# EAGLE schematic mf_tray_mb_v9 (EAGLE 8.0.1)

## Sheet 1 of 8: Arduino Mega 2560
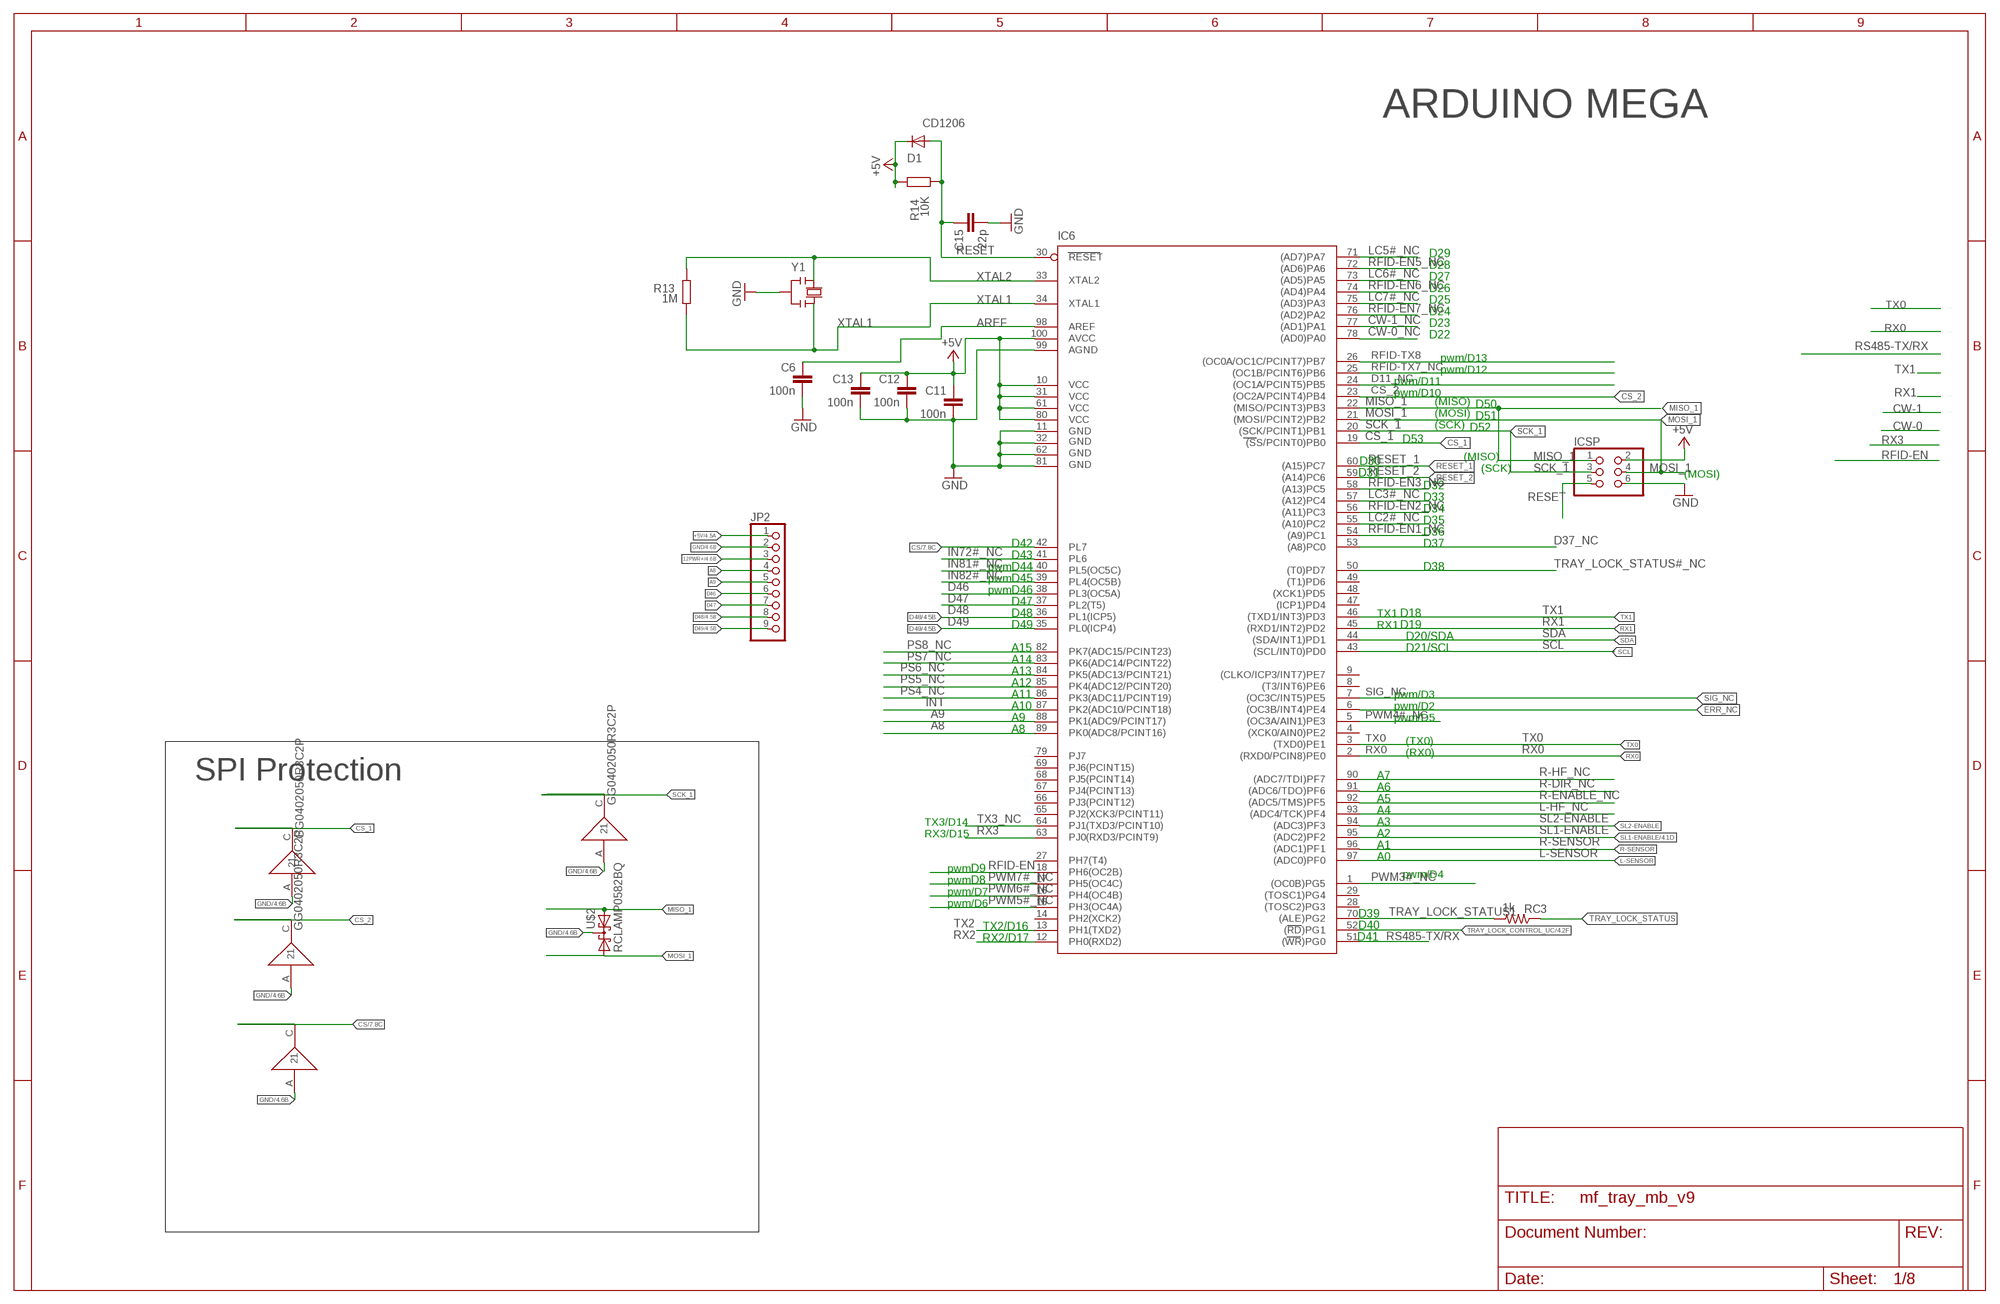
[diagram p0: schematic, sheet 1]

### Parts
C6  100n  C-EU0603-RND  [C0603-ROUND]
C11  100n  C-EU0603-RND  [C0603-ROUND]
C12  100n  C-EU0603-RND  [C0603-ROUND]
C13  100n  C-EU0603-RND  [C0603-ROUND]
C15  22p  C-EU0603-RND  [C0603-ROUND]
D1  CD1206  DIODE-MINIMELF  [MINIMELF]
IC6  ATMEGA25602560-16AU  [TQFP100]
ICSP  PINHD-2X3  [2X03]
JP2  PINHD-1X9  [1X09]
R13  1M  R-EU_R0603  [R0603-ROUND]
R14  10K  R-EU_R0603  [R0603-ROUND]
RC3  1k  R-US_R0603  [R0603@1]
U$1  GG0402050R3C2P  [0402]
U$2  RCLAMP0582BQ  [SOT416]
U$3  GG0402050R3C2P  [0402]
U$4  GG0402050R3C2P  [0402]
U$5  GG0402050R3C2P  [0402]
Y1  RESONATORMU  [RESONATOR]

### Nets
12PWR+ [power]: JP2.3 ; also sheet 2,4,6
+5V: C11.1 C12.1 C13.1 D1.C IC6.10(VCC) IC6.31(VCC1) IC6.61(VCC2) IC6.80(VCC3) IC6.100(AVCC) ICSP.2 JP2.1 R14.2 ; also sheet 2,3,4,5,6,7
A8: IC6.89(PK0(ADC8/PCINT16)) JP2.4
A9: IC6.88(PK1(ADC9/PCINT17)) JP2.5
AREF: C6.1 IC6.98(AREF)
CS: IC6.42(PL7) U$5.C ; also sheet 7
CS_1: IC6.19((SS/PCINT0)PB0) U$3.C ; also sheet 2
CS_2: IC6.23((OC2A/PCINT4)PB4) U$4.C ; also sheet 2
CW-0_NC: IC6.78((AD0)PA0)
CW-1_NC: IC6.77((AD1)PA1)
D11_NC: IC6.24((OC1A/PCINT5)PB5)
D37_NC: IC6.53((A8)PC0)
D46: IC6.38(PL3(OC5A)) JP2.6
D47: IC6.37(PL2(T5)) JP2.7
D48: IC6.36(PL1(ICP5)) JP2.8 ; also sheet 4
D49: IC6.35(PL0(ICP4)) JP2.9 ; also sheet 4
ERR_NC: IC6.6((OC3B/INT4)PE4)
GND: C6.2 C11.2 C12.2 C13.2 C15.2 IC6.11(GND) IC6.32(GND1) IC6.62(GND2) IC6.81(GND3) IC6.99(AGND) ICSP.6 JP2.2 U$1.A U$2.3(K1K2) U$3.A U$4.A U$5.A Y1.2 ; also sheet 2,3,4,5,6,7
IN72#_NC: IC6.41(PL6)
IN81#_NC: IC6.40(PL5(OC5C))
IN82#_NC: IC6.39(PL4(OC5B))
INT: IC6.87(PK2(ADC10/PCINT18)) ; also sheet 7
L-HF_NC: IC6.93((ADC4/TCK)PF4)
L-SENSOR: IC6.97((ADC0)PF0) ; also sheet 5
LC2#_NC: IC6.55((A10)PC2)
LC3#_NC: IC6.57((A12)PC4)
LC5#_NC: IC6.71((AD7)PA7)
LC6#_NC: IC6.73((AD5)PA5)
LC7#_NC: IC6.75((AD3)PA3)
MISO_1: IC6.22((MISO/PCINT3)PB3) ICSP.1 U$2.2(A2) ; also sheet 2,7
MOSI_1: IC6.21((MOSI/PCINT2)PB2) ICSP.4 U$2.1(A1) ; also sheet 2,7
PS4_NC: IC6.86(PK3(ADC11/PCINT19))
PS5_NC: IC6.85(PK4(ADC12/PCINT20))
PS6_NC: IC6.84(PK5(ADC13/PCINT21))
PS7_NC: IC6.83(PK6(ADC14/PCINT22))
PS8_NC: IC6.82(PK7(ADC15/PCINT23))
PWM3#_NC: IC6.1((OC0B)PG5)
PWM4#_NC: IC6.5((OC3A/AIN1)PE3)
PWM5#_NC: IC6.15(PH3(OC4A))
PWM6#_NC: IC6.16(PH4(OC4B))
PWM7#_NC: IC6.17(PH5(OC4C))
R-DIR_NC: IC6.91((ADC6/TDO)PF6)
R-ENABLE_NC: IC6.92((ADC5/TMS)PF5)
R-HF_NC: IC6.90((ADC7/TDI)PF7)
R-SENSOR: IC6.96((ADC1)PF1) ; also sheet 5
RESET: C15.1 D1.A IC6.30(RESET) ICSP.5 R14.1 ; also sheet 3
RESET_1: IC6.60((A15)PC7) ; also sheet 2
RESET_2: IC6.59((A14)PC6) ; also sheet 2
RFID-EN: IC6.18(PH6(OC2B)) ; also sheet 5
RFID-EN1_NC: IC6.54((A9)PC1)
RFID-EN2_NC: IC6.56((A11)PC3)
RFID-EN3_NC: IC6.58((A13)PC5)
RFID-EN5_NC: IC6.72((AD6)PA6)
RFID-EN6_NC: IC6.74((AD4)PA4)
RFID-EN7_NC: IC6.76((AD2)PA2)
RFID-TX7_NC: IC6.25((OC1B/PCINT6)PB6)
RFID-TX8: IC6.26((OC0A/OC1C/PCINT7)PB7) ; also sheet 3
RS485-TX/RX: IC6.51((WR)PG0) ; also sheet 3
RX0: IC6.2((RXD0/PCIN8)PE0) ; also sheet 3
RX1: IC6.45((RXD1/INT2)PD2) ; also sheet 3
RX2: IC6.12(PH0(RXD2)) ; also sheet 5
RX3: IC6.63(PJ0(RXD3/PCINT9)) ; also sheet 5
SCK_1: IC6.20((SCK/PCINT1)PB1) ICSP.3 U$1.C ; also sheet 2,7
SCL: IC6.43((SCL/INT0)PD0)
SDA: IC6.44((SDA/INT1)PD1)
SIG_NC: IC6.7((OC3C/INT5)PE5)
SL1-ENABLE: IC6.95((ADC2)PF2) ; also sheet 4
SL2-ENABLE: IC6.94((ADC3)PF3)
TRAY_LOCK_CONTROL_UC: IC6.52((RD)PG1) ; also sheet 4
TRAY_LOCK_STATUS [power]: RC3.1 ; also sheet 6
TRAY_LOCK_STATUS1: IC6.70((ALE)PG2) RC3.2
TRAY_LOCK_STATUS#_NC: IC6.50((T0)PD7)
TX0: IC6.3((TXD0)PE1) ; also sheet 3
TX1: IC6.46((TXD1/INT3)PD3) ; also sheet 3
TX2: IC6.13(PH1(TXD2)) ; also sheet 5
TX3_NC: IC6.64(PJ1(TXD3/PCINT10))
XTAL1: IC6.34(XTAL1) R13.1 Y1.3
XTAL2: IC6.33(XTAL2) R13.2 Y1.1
Unconnected: IC6.4((XCK0/AIN0)PE2) IC6.8((T3/INT6)PE6) IC6.9((CLKO/ICP3/INT7)PE7) IC6.14(PH2(XCK2)) IC6.27(PH7(T4)) IC6.28((TOSC2)PG3) IC6.29((TOSC1)PG4) IC6.47((ICP1)PD4) IC6.48((XCK1)PD5) IC6.49((T1)PD6) IC6.65(PJ2(XCK3/PCINT11)) IC6.66(PJ3(PCINT12)) IC6.67(PJ4(PCINT13)) IC6.68(PJ5(PCINT14)) IC6.69(PJ6(PCINT15)) IC6.79(PJ7)

### Notes on the sheet
- ARDUINO MEGA
- D29
- D28
- D27
- D26
- D25
- D24
- D23
- D22
- pwm/D13
- pwm/D12
- pwm/D11
- pwm/D10
- (MISO) | D50
- (MOSI) | D51
- (SCK) | D52
- D53
- (MISO)
- D30
- (SCK)
- D31 | (MOSI)
- D32
- D33
- D34
- D35
- D36
- D42 | D37
- D43
- pwm | D44 | D38
- pwm | D45
- pwm | D46
- D47
- D48 | TX1 | D18
- D49 | RX1 | D19
- D20/SDA
- A15 | D21/SCL
- A14
- A13
- A12
- A11 | pwm/D3
- A10 | pwm/D2
- A9 | pwm/D5
- A8
- (TX0)
- (RX0)
- SPI Protection | A7
- A6
- A5
- A4
- TX3/D14 | A3
- RX3/D15 | A2
- A1
- A0
- pwm | D9
- pwm/D4
- pwm | D8
- pwm/D7
- pwm/D6
- D39
- TX2/D16 | D40
- RX2/D17 | D41

## Sheet 2 of 8: L6470
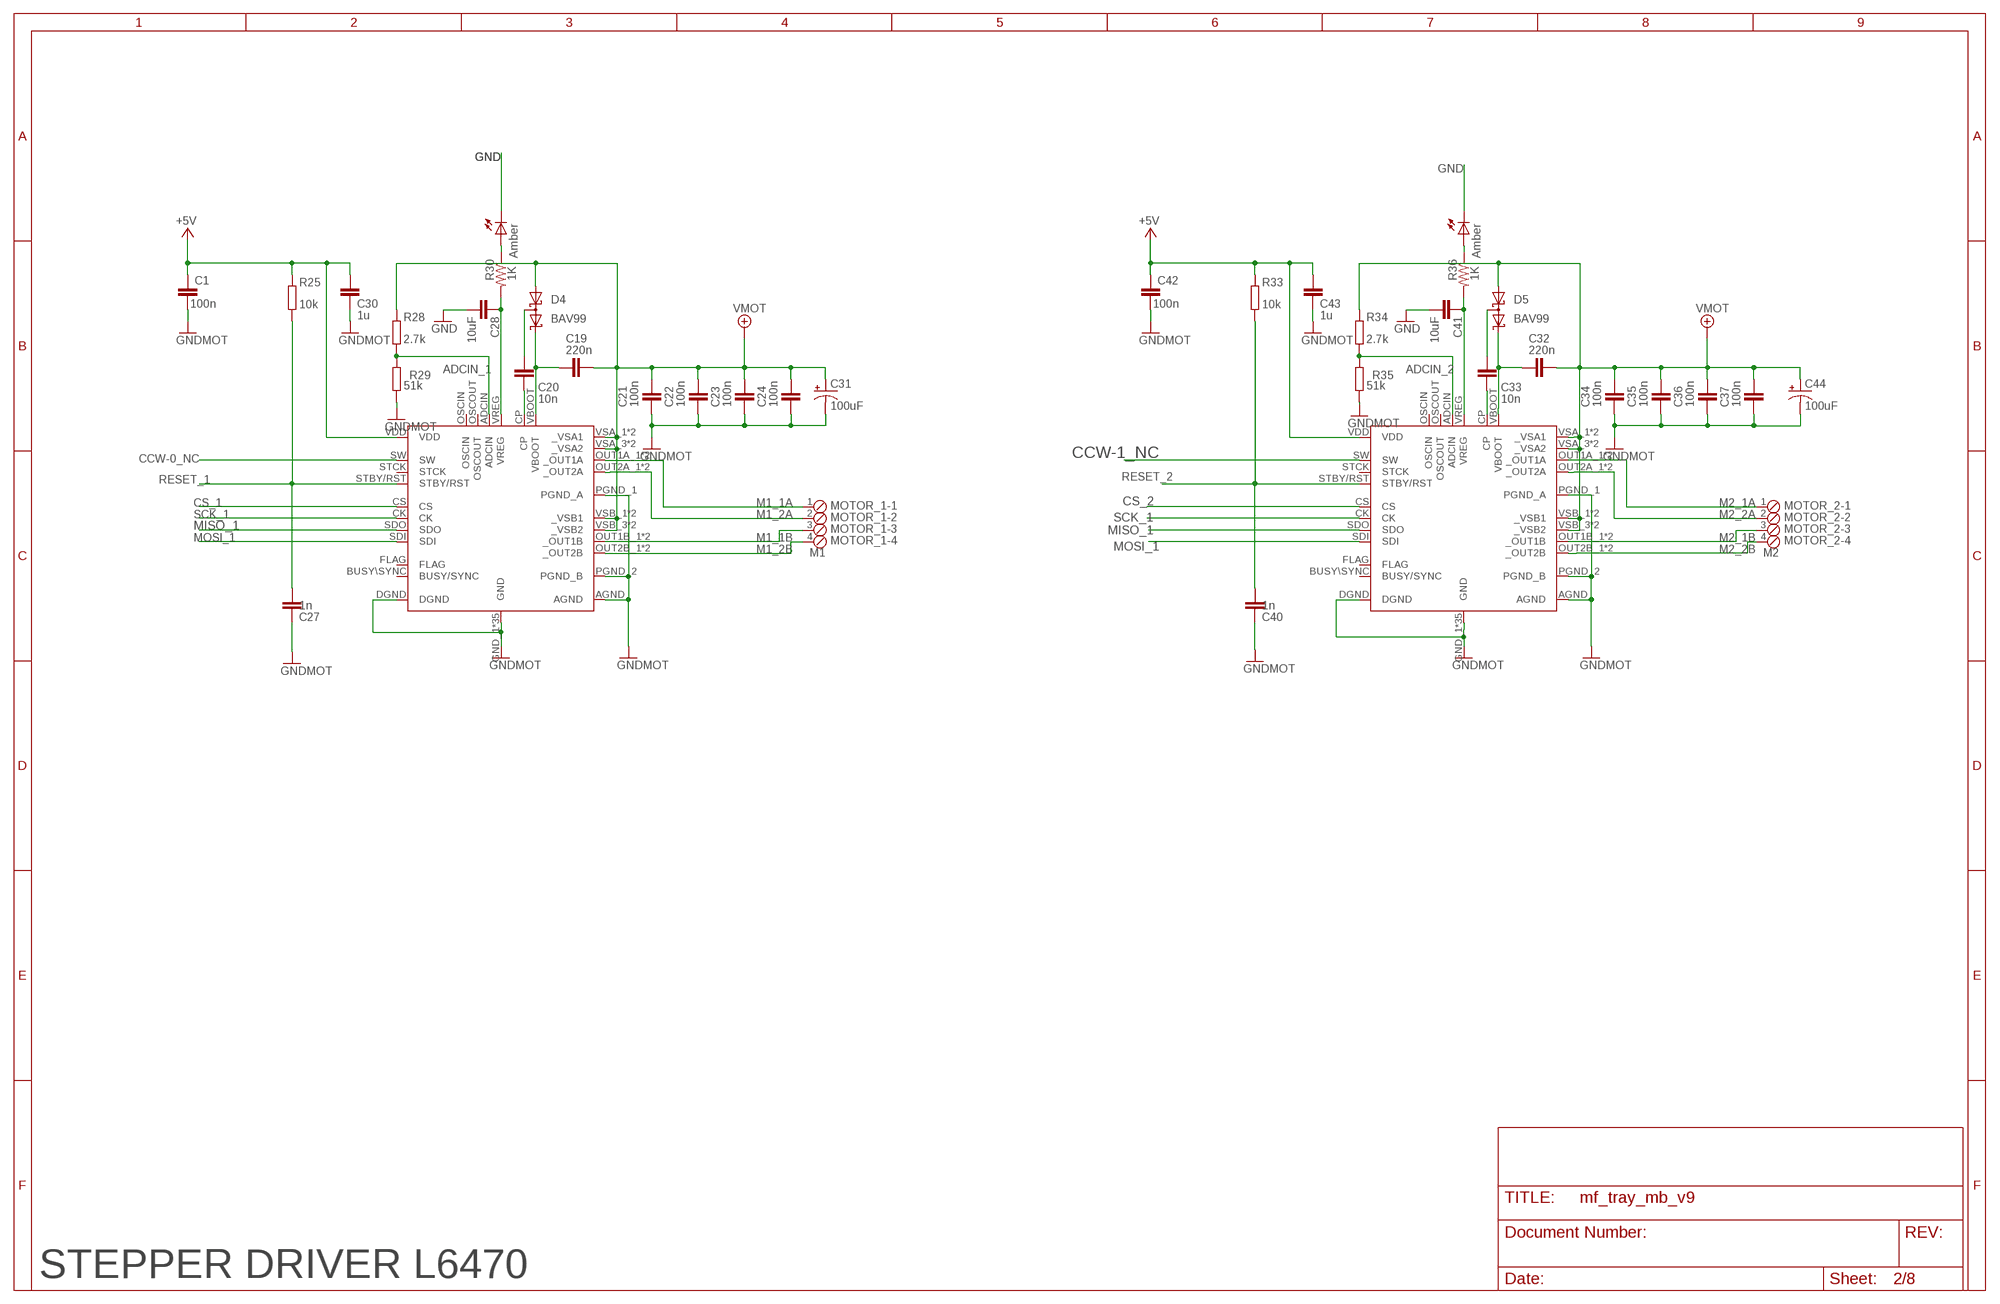
[diagram p1: schematic, sheet 2]

### Parts
C1  100n  C-EUC0603K  [C0603K]
C19  220n  C-EUC0603K  [C0603K]
C20  10n  C-EUC0603K  [C0603K]
C21  100n  C-EUC0603K  [C0603K]
C22  100n  C-EUC0603K  [C0603K]
C23  100n  C-EUC0603K  [C0603K]
C24  100n  C-EUC0603K  [C0603K]
C27  1n  C-EUC0603K  [C0603K]
C28  10uF  C-EUC0603  [C0603]
C30  1u  C-EUC0603K  [C0603K]
C31  100uF  100UF-63V-20%(ELECT)  [NIC_10X10.5_CAP]
C32  220n  C-EUC0603K  [C0603K]
C33  10n  C-EUC0603K  [C0603K]
C34  100n  C-EUC0603K  [C0603K]
C35  100n  C-EUC0603K  [C0603K]
C36  100n  C-EUC0603K  [C0603K]
C37  100n  C-EUC0603K  [C0603K]
C40  1n  C-EUC0603K  [C0603K]
C41  10uF  C-EUC0603  [C0603]
C42  100n  C-EUC0603K  [C0603K]
C43  1u  C-EUC0603K  [C0603K]
C44  100uF  100UF-63V-20%(ELECT)  [NIC_10X10.5_CAP]
D4  BAV99  BAT54S  [SOT23]
D5  BAV99  BAT54S  [SOT23]
IC$1  L6470L6470_4L_2_15  [L6470_4L_2_15-POWERSO36]
IC$2  L6470L6470_4L_2_15  [L6470_4L_2_15-POWERSO36]
L20  Amber  LED0603  [LED-0603]
L21  Amber  LED0603  [LED-0603]
MOTOR_1  M1  MPT4  [4POL254]
MOTOR_2  M2  MPT4  [4POL254]
R25  10k  R-EU_R0603  [R0603]
R28  2.7k  R-EU_R0603  [R0603]
R29  51k  R-EU_R0603  [R0603]
R30  1K  RESISTOR0603-RES  [0603-RES]
R33  10k  R-EU_R0603  [R0603]
R34  2.7k  R-EU_R0603  [R0603]
R35  51k  R-EU_R0603  [R0603]
R36  1K  RESISTOR0603-RES  [0603-RES]

### Nets
12PWR+ [power]: C19.2 C21.2 C22.2 C23.2 C24.2 C31.+ C32.2 C34.2 C35.2 C36.2 C37.2 C44.+ D4.1(A1) D5.1(A1) IC$1.VSA_1(_VSA1) IC$1.VSA_2(_VSA1) IC$1.VSA_3(_VSA2) IC$1.VSA_4(_VSA2) IC$1.VSB_1(_VSB1) IC$1.VSB_2(_VSB1) IC$1.VSB_3(_VSB2) IC$1.VSB_4(_VSB2) IC$2.VSA_1(_VSA1) IC$2.VSA_2(_VSA1) IC$2.VSA_3(_VSA2) IC$2.VSA_4(_VSA2) IC$2.VSB_1(_VSB1) IC$2.VSB_2(_VSB1) IC$2.VSB_3(_VSB2) IC$2.VSB_4(_VSB2) R28.2 R34.2 ; supply symbol labelled VMOT ; also sheet 1,4,6
+5V: C1.2 C30.2 C42.2 C43.2 IC$1.VDD IC$2.VDD R25.2 R33.2 ; also sheet 1,3,4,5,6,7
ADCIN_1: IC$1.ADCIN R28.1 R29.2
ADCIN_2: IC$2.ADCIN R34.1 R35.2
CCW-0_NC: IC$1.SW
CCW-1_NC: IC$2.SW
CS_1: IC$1.CS ; also sheet 1
CS_2: IC$2.CS ; also sheet 1
GND: C1.1 C21.1 C22.1 C23.1 C24.1 C27.1 C28.2 C30.1 C31.- C34.1 C35.1 C36.1 C37.1 C40.1 C41.2 C42.1 C43.1 C44.- IC$1.AGND IC$1.DGND IC$1.GND_1(GND) IC$1.GND_2(GND) IC$1.GND_3(GND) IC$1.GND_4(GND) IC$1.GND_5(GND) IC$1.GND_6(GND) IC$1.GND_7(GND) IC$1.GND_8(GND) IC$1.GND_9(GND) IC$1.GND_10(GND) IC$1.GND_11(GND) IC$1.GND_12(GND) IC$1.GND_13(GND) IC$1.GND_14(GND) IC$1.GND_15(GND) IC$1.GND_16(GND) IC$1.GND_17(GND) IC$1.GND_18(GND) IC$1.GND_19(GND) IC$1.GND_20(GND) IC$1.GND_21(GND) IC$1.GND_22(GND) IC$1.GND_23(GND) IC$1.GND_24(GND) IC$1.GND_25(GND) IC$1.GND_26(GND) IC$1.GND_27(GND) IC$1.GND_28(GND) IC$1.GND_29(GND) IC$1.GND_30(GND) IC$1.GND_31(GND) IC$1.GND_32(GND) IC$1.GND_33(GND) IC$1.GND_34(GND) IC$1.GND_35(GND) IC$1.PGND_1(PGND_A) IC$1.PGND_2(PGND_B) IC$2.AGND IC$2.DGND IC$2.GND_1(GND) IC$2.GND_2(GND) IC$2.GND_3(GND) IC$2.GND_4(GND) IC$2.GND_5(GND) IC$2.GND_6(GND) IC$2.GND_7(GND) IC$2.GND_8(GND) IC$2.GND_9(GND) IC$2.GND_10(GND) IC$2.GND_11(GND) IC$2.GND_12(GND) IC$2.GND_13(GND) IC$2.GND_14(GND) IC$2.GND_15(GND) IC$2.GND_16(GND) IC$2.GND_17(GND) IC$2.GND_18(GND) IC$2.GND_19(GND) IC$2.GND_20(GND) IC$2.GND_21(GND) IC$2.GND_22(GND) IC$2.GND_23(GND) IC$2.GND_24(GND) IC$2.GND_25(GND) IC$2.GND_26(GND) IC$2.GND_27(GND) IC$2.GND_28(GND) IC$2.GND_29(GND) IC$2.GND_30(GND) IC$2.GND_31(GND) IC$2.GND_32(GND) IC$2.GND_33(GND) IC$2.GND_34(GND) IC$2.GND_35(GND) IC$2.PGND_1(PGND_A) IC$2.PGND_2(PGND_B) L20.C L21.C R29.1 R35.1 ; supply symbol labelled GNDMOT ; also sheet 1,3,4,5,6,7
M1_1A [0.900]: IC$1.OUT1A_1(_OUT1A) IC$1.OUT1A_2(_OUT1A) MOTOR_1.1
M1_1B [0.900]: IC$1.OUT1B_1(_OUT1B) IC$1.OUT1B_2(_OUT1B) MOTOR_1.3
M1_2A [0.900]: IC$1.OUT2A_1(_OUT2A) IC$1.OUT2A_2(_OUT2A) MOTOR_1.2
M1_2B [0.900]: IC$1.OUT2B_1(_OUT2B) IC$1.OUT2B_2(_OUT2B) MOTOR_1.4
M2_1A [0.900]: IC$2.OUT1A_1(_OUT1A) IC$2.OUT1A_2(_OUT1A) MOTOR_2.1
M2_1B [0.900]: IC$2.OUT1B_1(_OUT1B) IC$2.OUT1B_2(_OUT1B) MOTOR_2.3
M2_2A [0.900]: IC$2.OUT2A_1(_OUT2A) IC$2.OUT2A_2(_OUT2A) MOTOR_2.2
M2_2B [0.900]: IC$2.OUT2B_1(_OUT2B) IC$2.OUT2B_2(_OUT2B) MOTOR_2.4
MISO_1: IC$1.SDO IC$2.SDO ; also sheet 1,7
MOSI_1: IC$1.SDI IC$2.SDI ; also sheet 1,7
N$16: C19.1 D4.2(C2) IC$1.VBOOT
N$17: C20.1 IC$1.CP
N$18: C20.2 D4.3(C1A2)
N$19: L20.A R30.1
N$20: C28.1 IC$1.VREG R30.2
N$24: L21.A R36.1
N$55: C32.1 D5.2(C2) IC$2.VBOOT
N$56: C33.1 IC$2.CP
N$57: C33.2 D5.3(C1A2)
N$59: C41.1 IC$2.VREG R36.2
RESET_1: C27.2 IC$1.STBY/RST R25.1 ; also sheet 1
RESET_2: C40.2 IC$2.STBY/RST R33.1 ; also sheet 1
SCK_1: IC$1.CK IC$2.CK ; also sheet 1,7
Unconnected: IC$1.BUSY\SYNC(BUSY/SYNC) IC$1.FLAG IC$1.OSCIN IC$1.OSCOUT IC$1.STCK IC$2.BUSY\SYNC(BUSY/SYNC) IC$2.FLAG IC$2.OSCIN IC$2.OSCOUT IC$2.STCK

### Notes on the sheet
- STEPPER DRIVER L6470

## Sheet 3 of 8: Communication
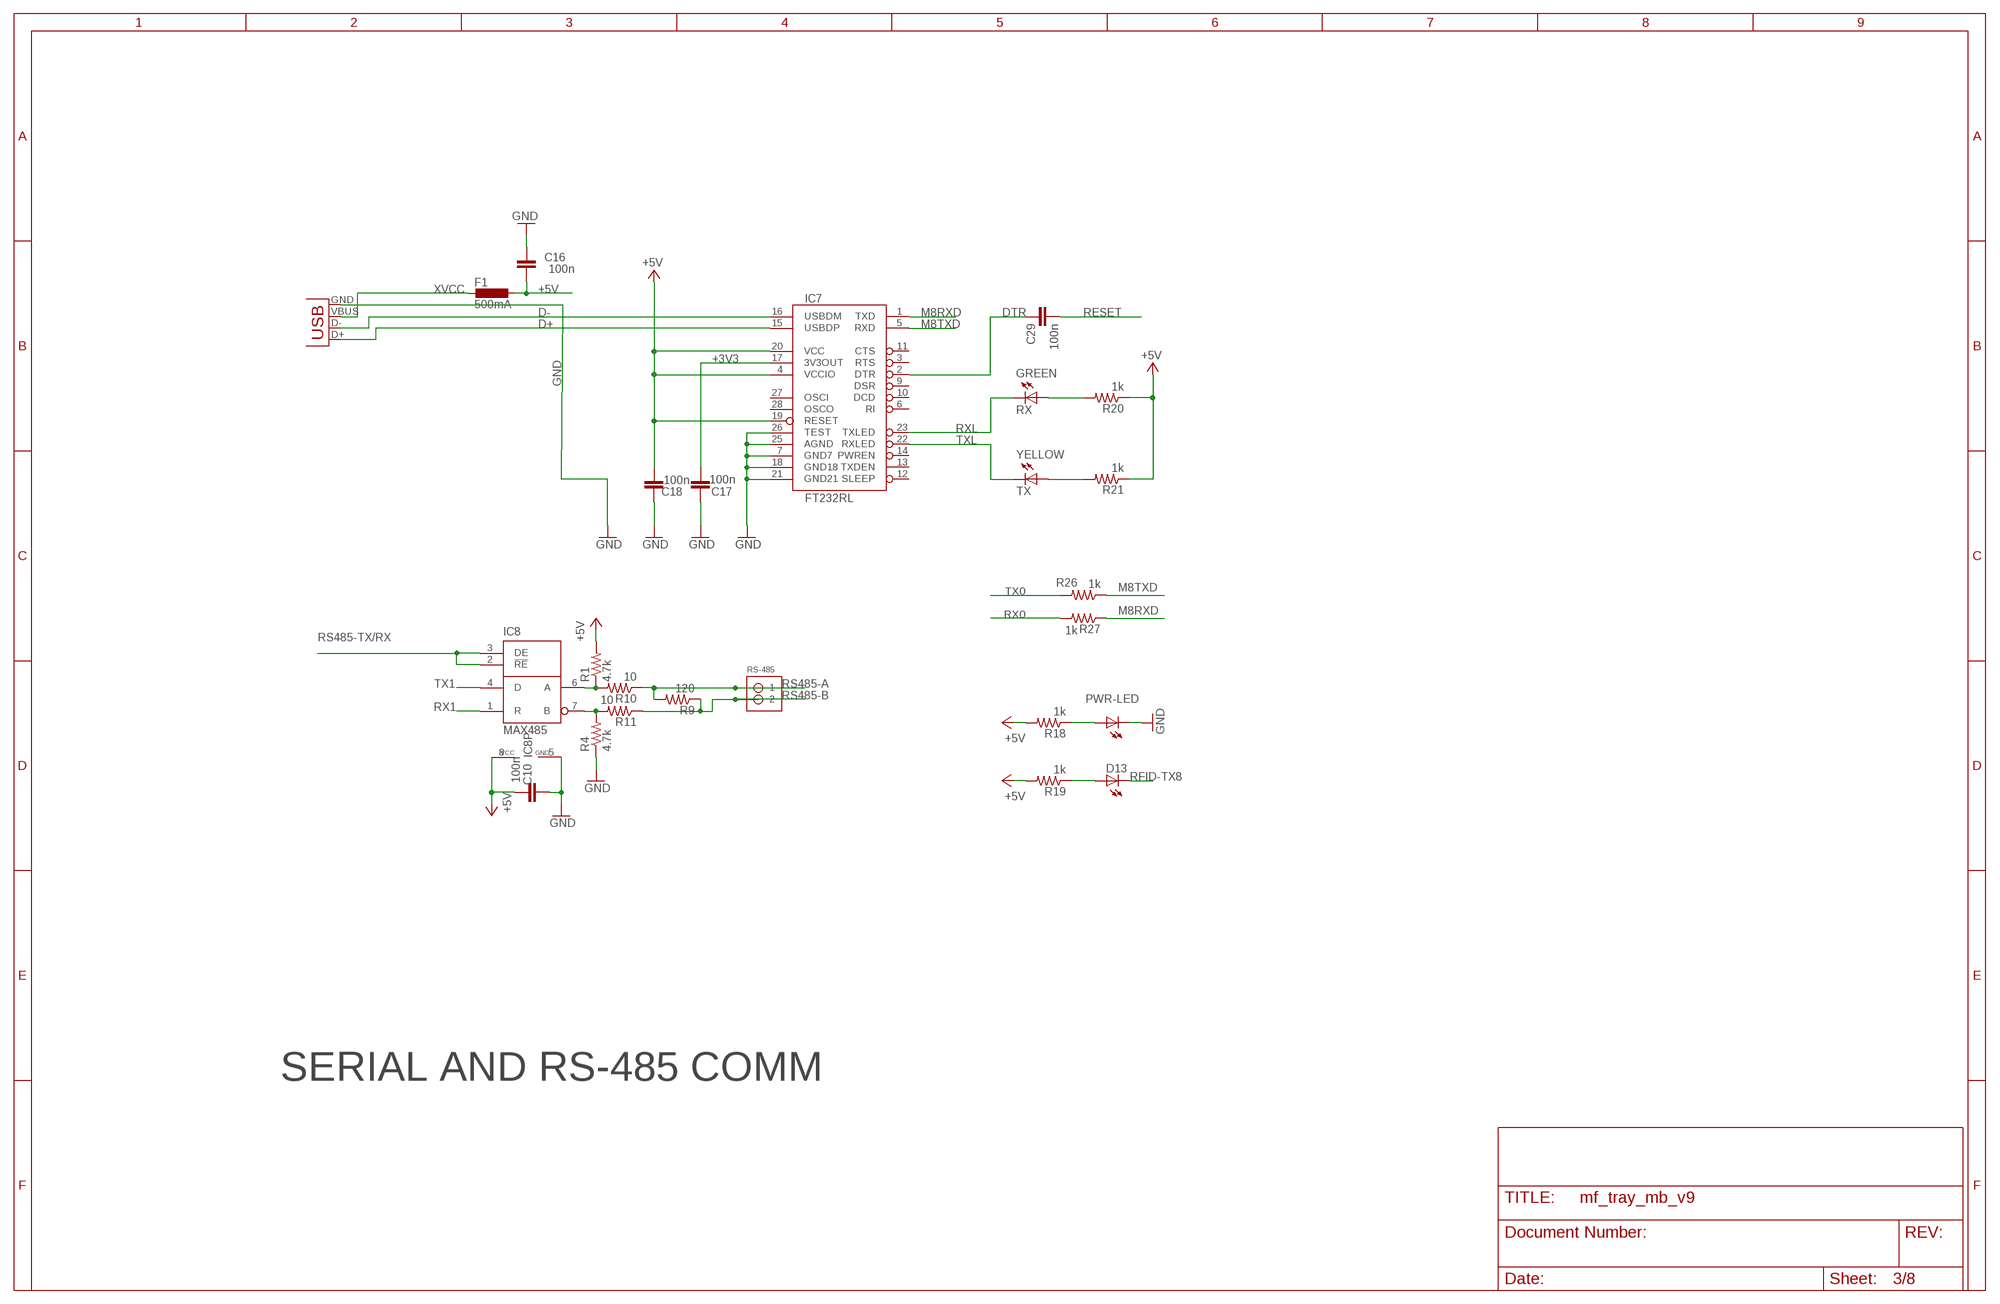
[diagram p2: schematic, sheet 3]

### Parts
C10  100n  C-EU0603-RND  [C0603-ROUND]
C16  100n  C-EUC0603  [C0603]
C17  100n  C-EU0603-RND  [C0603-ROUND]
C18  100n  C-EU0603-RND  [C0603-ROUND]
C29  100n  C-EU0603-RND  [C0603-ROUND]
D13  LEDCHIPLED_0603  [CHIPLED_0603]
F1  500mA  L-EUL1812  [L1812]
IC7  FT232RL  FT232RLSSOP  [SSOP28DB]
IC8  MAX485  75ALS176AD  [SO-08]
PWR-LED  LEDCHIPLED_0603  [CHIPLED_0603]
R1  4.7k  R-US_R0603  [R0603@1]
R4  4.7k  R-US_R0603  [R0603@1]
R9  120  R-US_R0603  [R0603@1]
R10  10  R-US_R0603  [R0603@1]
R11  10  R-US_R0603  [R0603@1]
R18  1k  R-US_R0603  [R0603@1]
R19  1k  R-US_R0603  [R0603@1]
R20  1k  R-US_R0603  [R0603@1]
R21  1k  R-US_R0603  [R0603@1]
R26  1k  R-US_R0603  [R0603@1]
R27  1k  R-US_R0603  [R0603@1]
RS-485  JST-PH_2-PIN_HEADER  [JST_B2B-PH_HEADER]
RX  GREEN  LEDCHIPLED_0603  [CHIPLED_0603]
TX  YELLOW  LEDCHIPLED_0603  [CHIPLED_0603]
USB  USB  USBPTH-VERTICAL  [USB-B-PTH-VERTICAL]

### Nets
+3V3: C17.2 IC7.17(3V3OUT) ; also sheet 7
+5V: C10.1 C16.1 C18.1 F1.1 IC7.4(VCCIO) IC7.19(RESET) IC7.20(VCC) IC8.8(VCC) R1.2 R18.2 R19.2 R20.1 R21.1 ; also sheet 1,2,4,5,6,7
D+: IC7.15(USBDP) USB.D+
D-: IC7.16(USBDM) USB.D-
DTR: C29.1 IC7.2(DTR)
GND: C10.2 C16.2 C17.1 C18.2 IC7.7(GND7) IC7.18(GND18) IC7.21(GND21) IC7.25(AGND) IC7.26(TEST) IC8.5(GND) PWR-LED.C R4.1 USB.GND ; also sheet 1,2,4,5,6,7
M8RXD: IC7.1(TXD) R27.1
M8TXD: IC7.5(RXD) R26.1
N$1: PWR-LED.A R18.1
N$4: D13.A R19.1
N$6: R21.2 TX.A
N$26: IC8.6(A) R1.1 R10.2
N$27: IC8.7(B) R4.2 R11.2
N$28: R20.2 RX.A
RESET: C29.2 ; also sheet 1
RFID-TX8: D13.C ; also sheet 1
RS485-A: R9.2 R10.1 RS-485.P1 ; also sheet 6
RS485-B: R9.1 R11.1 RS-485.P2 ; also sheet 6
RS485-TX/RX: IC8.2(!RE) IC8.3(DE) ; also sheet 1
RX0: R27.2 ; also sheet 1
RX1: IC8.1(R) ; also sheet 1
RXL: IC7.23(TXLED) RX.C
TX0: R26.2 ; also sheet 1
TX1: IC8.4(D) ; also sheet 1
TXL: IC7.22(RXLED) TX.C
XVCC [power]: F1.2 USB.VBUS
Unconnected: IC7.3(RTS) IC7.6(RI) IC7.9(DSR) IC7.10(DCD) IC7.11(CTS) IC7.12(SLEEP) IC7.13(TXDEN) IC7.14(PWREN) IC7.27(OSCI) IC7.28(OSCO)

### Notes on the sheet
- SERIAL AND RS-485 COMM

## Sheet 4 of 8: Solenoid & EM Lock And Sensor
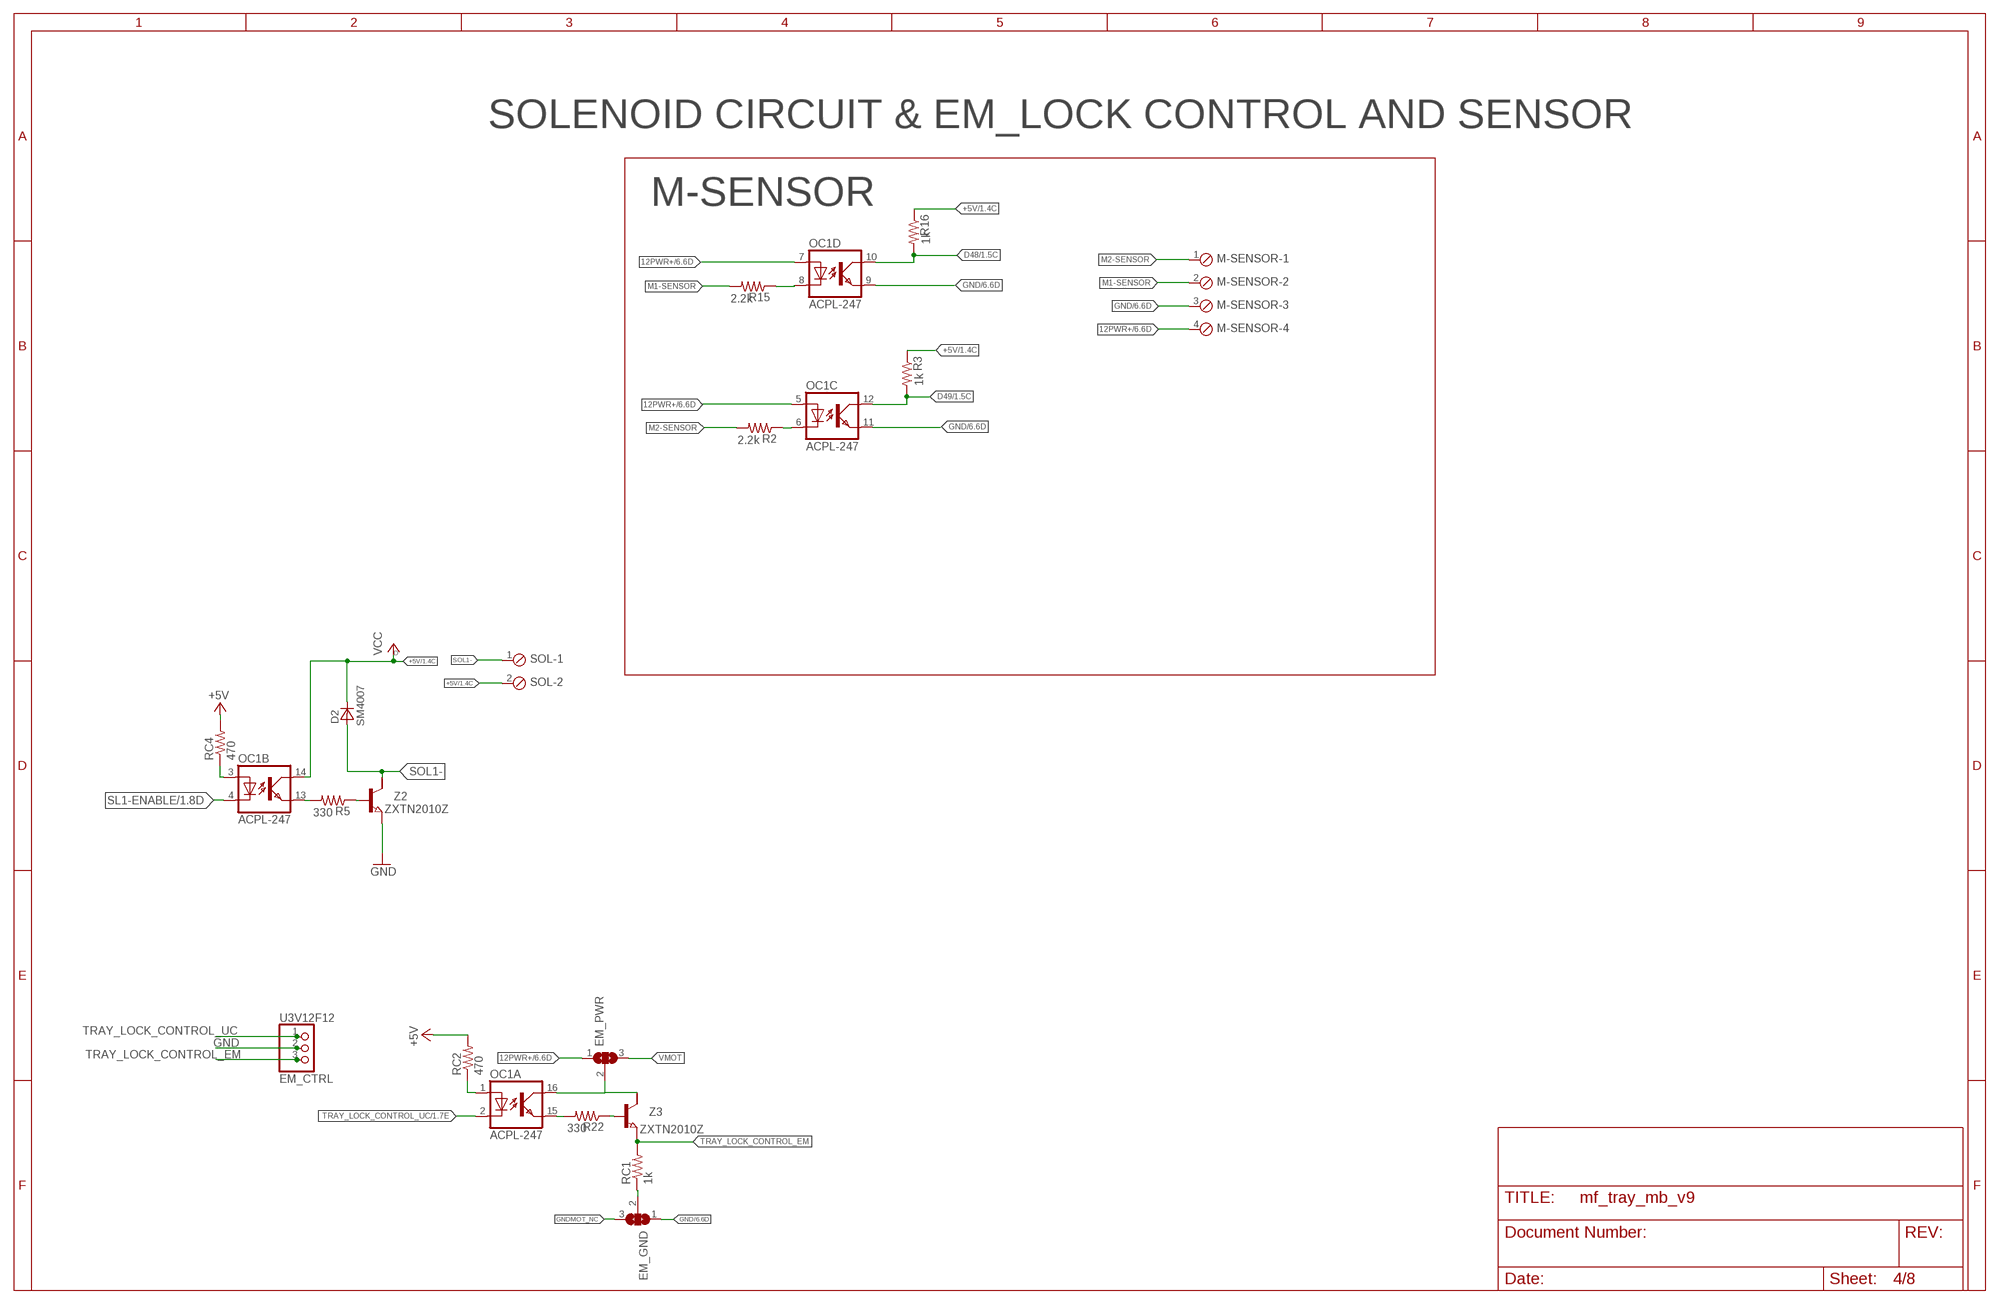
[diagram p3: schematic, sheet 4]

### Parts
D2  SM4007  [MELF-MLL41]
EM_GND  SJ2WW  [SJ_2W]
EM_PWR  SJ2WW  [SJ_2W]
M-SENSOR  MPT4  [4POL254]
OC1  ACPL-247  [SOP16]
R2  2.2k  R-US_R0603  [R0603@1]
R3  1k  R-US_R0603  [R0603@1]
R5  330  R-US_R0603  [R0603@1]
R15  2.2k  R-US_R0603  [R0603@1]
R16  1k  R-US_R0603  [R0603@1]
R22  330  R-US_R0603  [R0603@1]
RC1  1k  R-US_R0603  [R0603@1]
RC2  470  R-US_R0603  [R0603@1]
RC4  470  R-US_R0603  [R0603@1]
SOL  MPT2  [2POL254]
U3V12F12  EM_CTRL  PINHD-1X3  [1X03]
Z2  ZXTN2010Z  NPN-TRANSISTIOR-2COLSOT89  [SOT89]
Z3  ZXTN2010Z  NPN-TRANSISTIOR-2COLSOT89  [SOT89]

### Nets
12PWR+ [power]: EM_PWR.1 M-SENSOR.4 OC1.5(C:A) OC1.7(D:A) ; also sheet 1,2,6
+5V: D2.C OC1.14(B:COL) R3.1 R16.1 RC2.2 RC4.2 SOL.2 ; supply symbol labelled VCC ; also sheet 1,2,3,5,6,7
D48: OC1.10(D:COL) R16.2 ; also sheet 1
D49: OC1.12(C:COL) R3.2 ; also sheet 1
GND: EM_GND.1 M-SENSOR.3 OC1.9(D:EMIT) OC1.11(C:EMIT) U3V12F12.2 Z2.3(E) ; also sheet 1,2,3,5,6,7
GNDMOT_NC [power]: EM_GND.3 ; also sheet 6
M1-SENSOR: M-SENSOR.2 R15.2
M2-SENSOR: M-SENSOR.1 R2.2
N$2: OC1.1(A:A) RC2.1
N$3: OC1.15(A:EMIT) R22.2
N$5: OC1.3(B:A) RC4.1
N$7: OC1.13(B:EMIT) R5.2
N$8: R5.1 Z2.1(B)
N$9: OC1.8(D:C) R15.1
N$10: OC1.6(C:C) R2.1
N$11 [power]: EM_PWR.2 OC1.16(A:COL) Z3.2(C)
N$12: R22.1 Z3.1(B)
N$13 [power]: EM_GND.2 RC1.1
SL1-ENABLE: OC1.4(B:C) ; also sheet 1
SOL1-: D2.A SOL.1 Z2.2(C)
TRAY_LOCK_CONTROL_EM [power]: RC1.2 U3V12F12.3 Z3.3(E) ; also sheet 6
TRAY_LOCK_CONTROL_UC: OC1.2(A:C) U3V12F12.1 ; also sheet 1
VMOT [power]: EM_PWR.3 ; also sheet 6
Unconnected: Z2.2@1(C/) Z3.2@1(C/)

### Notes on the sheet
- SOLENOID CIRCUIT & EM_LOCK CONTROL AND SENSOR
- M-SENSOR
- D

## Sheet 5 of 8: RFID, FP, L/R Sensor
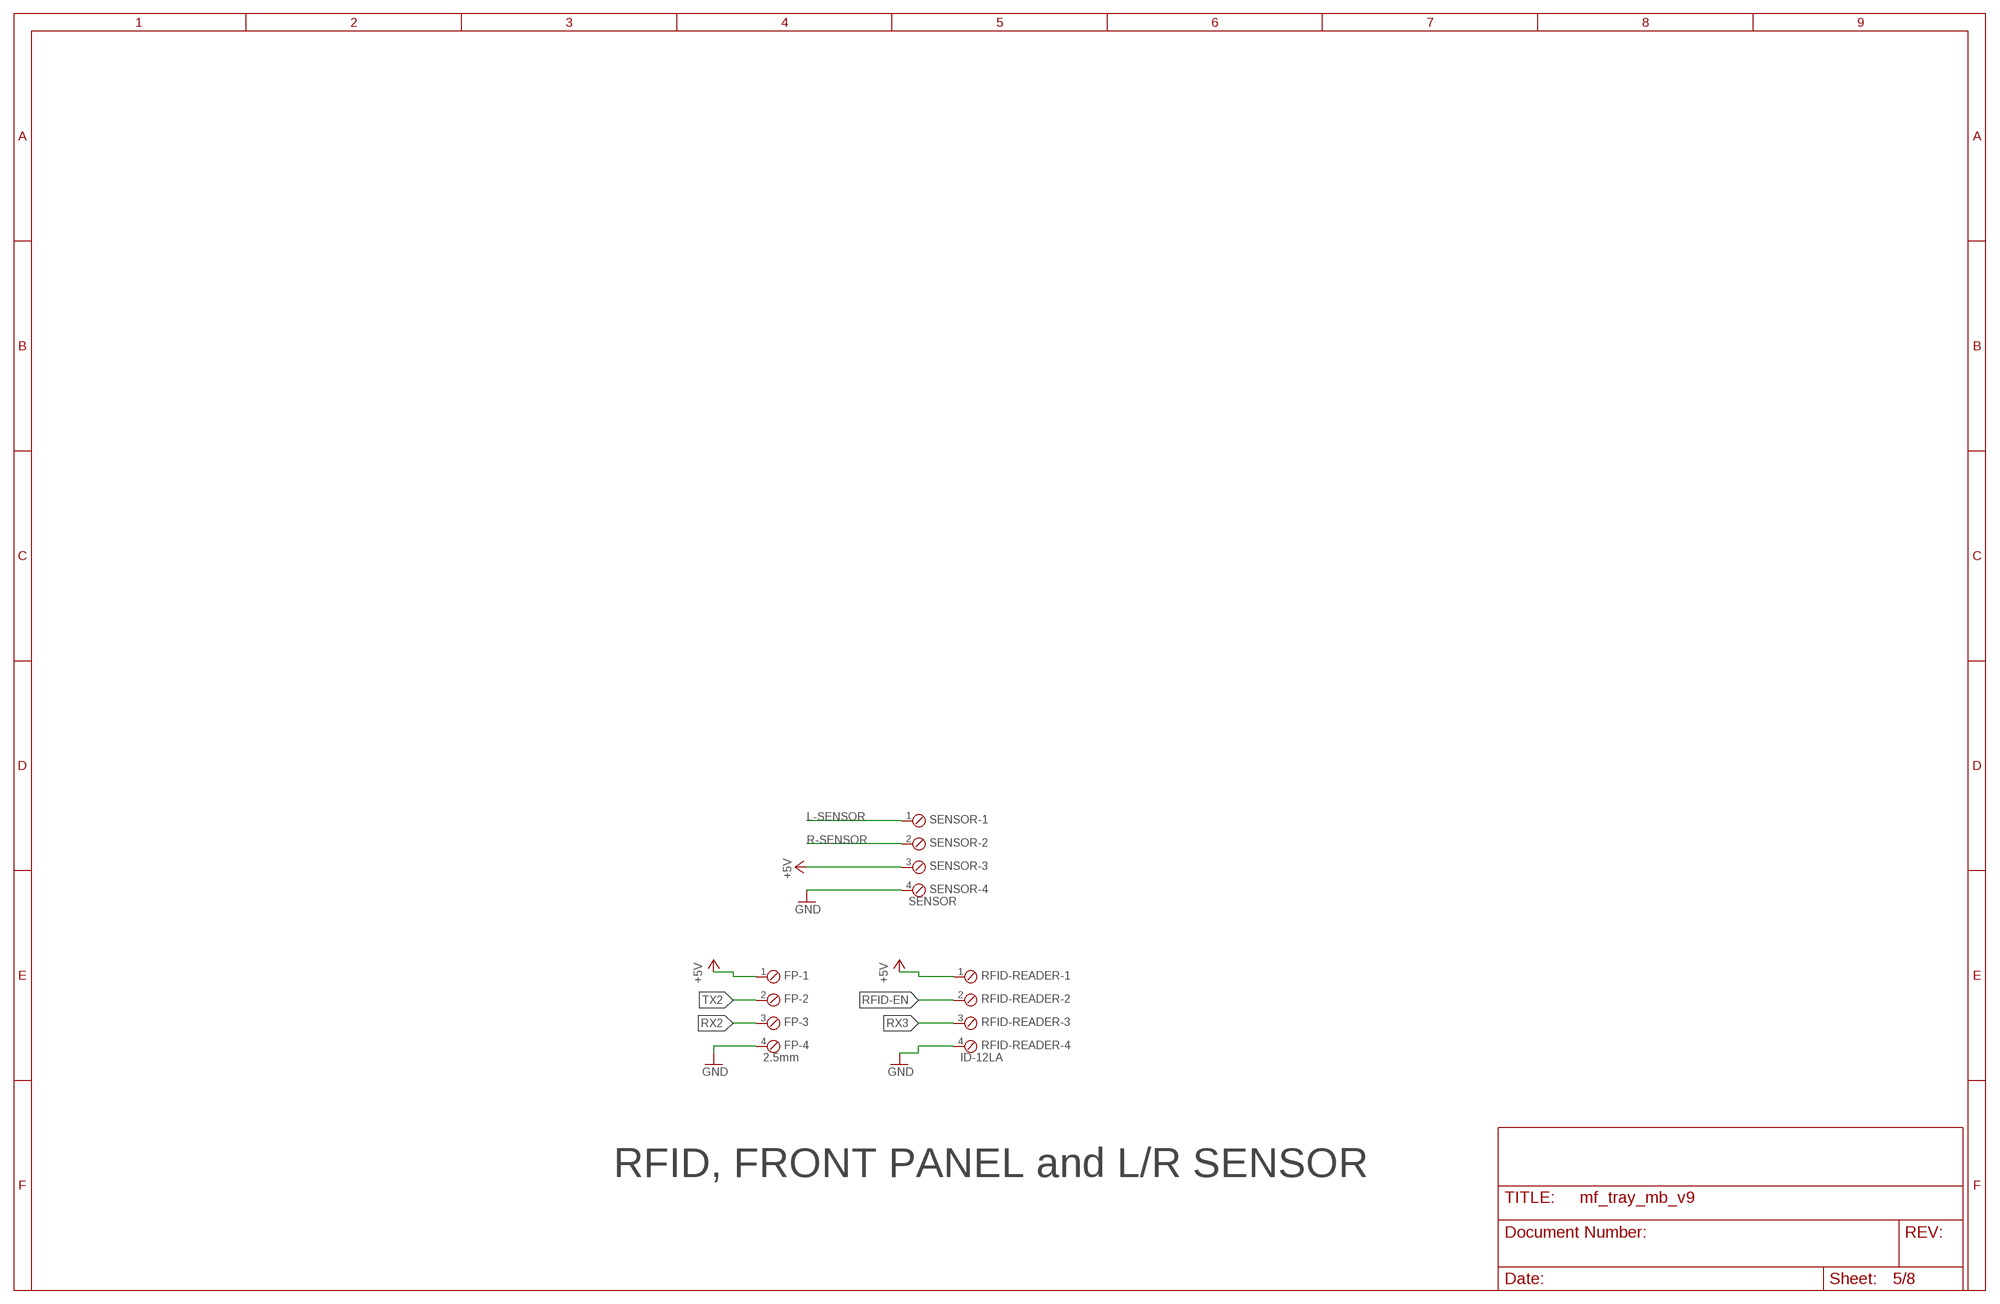
[diagram p4: schematic, sheet 5]

### Parts
FP  2.5mm  MPT4  [4POL254]
RFID-READER  ID-12LA  MPT4  [4POL254]
SENSOR  SENSOR  MPT4  [4POL254]

### Nets
+5V: FP.1 RFID-READER.1 SENSOR.3 ; also sheet 1,2,3,4,6,7
GND: FP.4 RFID-READER.4 SENSOR.4 ; also sheet 1,2,3,4,6,7
L-SENSOR: SENSOR.1 ; also sheet 1
R-SENSOR: SENSOR.2 ; also sheet 1
RFID-EN: RFID-READER.2 ; also sheet 1
RX2: FP.3 ; also sheet 1
RX3: RFID-READER.3 ; also sheet 1
TX2: FP.2 ; also sheet 1

### Notes on the sheet
- RFID, FRONT PANEL and L/R SENSOR

## Sheet 6 of 8: EM Lock & PWR Distribution
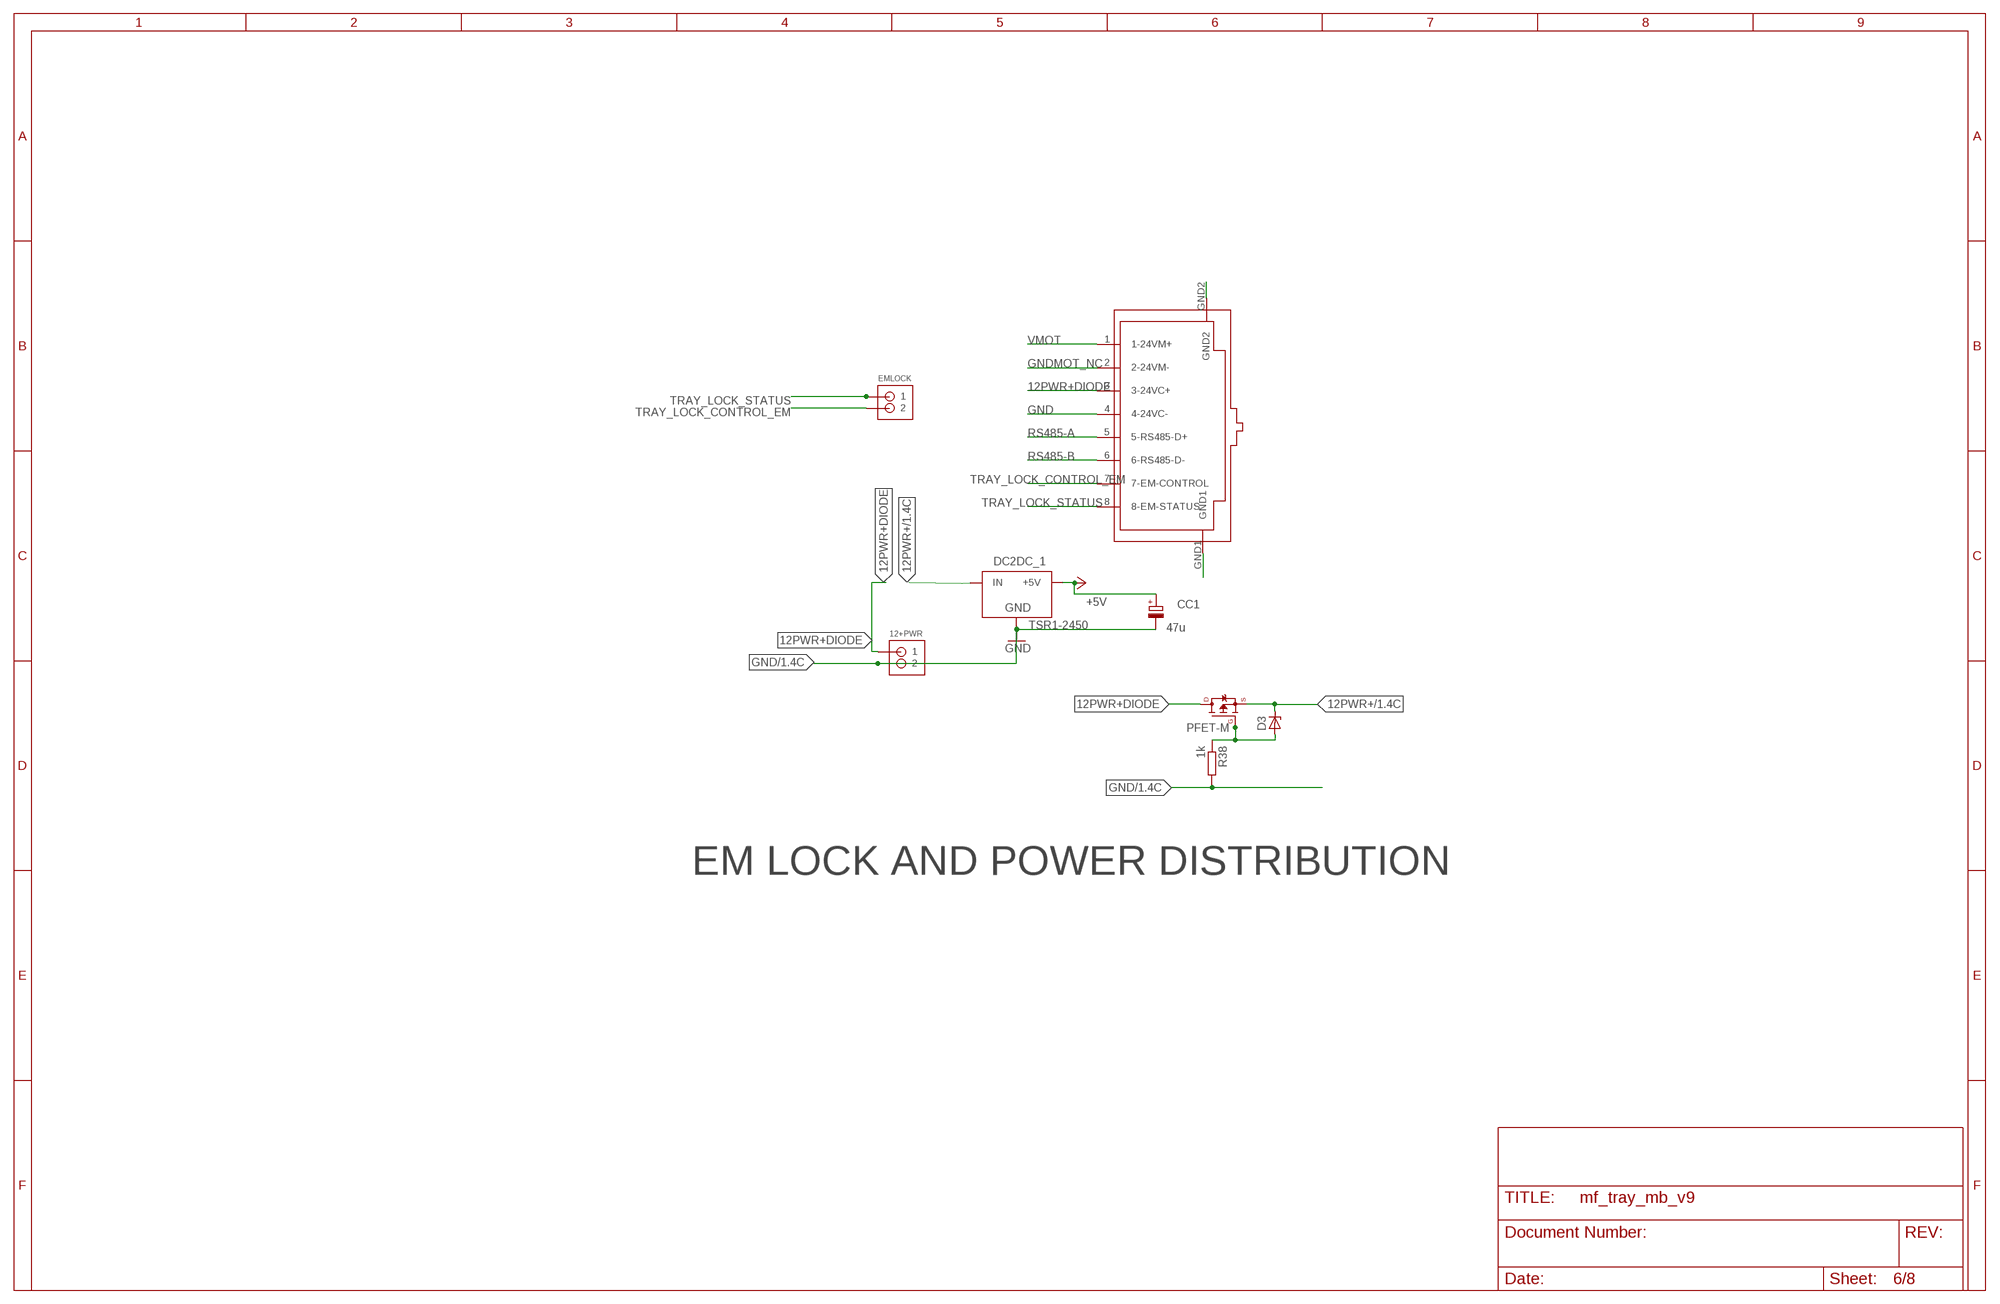
[diagram p5: schematic, sheet 6]

### Parts
12+PWR  JST-PH_2-PIN_HEADER  [JST_B2B-PH_HEADER]
CC1  47u  CPOL-EUD  [PANASONIC_D]
D3  1SMA5925BT3G  [DO214AC]
DC2DC_1  TSR1-2450  [TSR-1]
EMLOCK  JST-PH_2-PIN_HEADER  [JST_B2B-PH_HEADER]
PFET-M  FQP47P06NORMAL  [FQP47P06-NORMAL]
R38  1k  R-EU_R0603  [R0603]
U$10  RJ45-TOP-1-406541-1-CAN-MB  [RJ45-TOP]

### Nets
12PWR+ [power]: D3.C DC2DC_1.1(IN) PFET-M.3(S) ; also sheet 1,2,4
12PWR+DIODE [0.900]: 12+PWR.P1 PFET-M.2(D) U$10.3(3-24VC+)
+5V: CC1.+ DC2DC_1.3(+5V) ; also sheet 1,2,3,4,5,7
GND: 12+PWR.P2 CC1.- DC2DC_1.2(GND) R38.2 U$10.4(4-24VC-) U$10.GND1 U$10.GND2 ; also sheet 1,2,3,4,5,7
GNDMOT_NC [power]: U$10.2(2-24VM-) ; also sheet 4
N$14: D3.A PFET-M.1(G) R38.1
RS485-A: U$10.5(5-RS485-D+) ; also sheet 3
RS485-B: U$10.6(6-RS485-D-) ; also sheet 3
TRAY_LOCK_CONTROL_EM [power]: EMLOCK.P2 U$10.7(7-EM-CONTROL) ; also sheet 4
TRAY_LOCK_STATUS [power]: EMLOCK.P1 U$10.8(8-EM-STATUS) ; also sheet 1
VMOT [power]: U$10.1(1-24VM+) ; also sheet 4

### Notes on the sheet
- EM LOCK AND POWER DISTRIBUTION

## Sheet 7 of 8: ETHERNET COMM
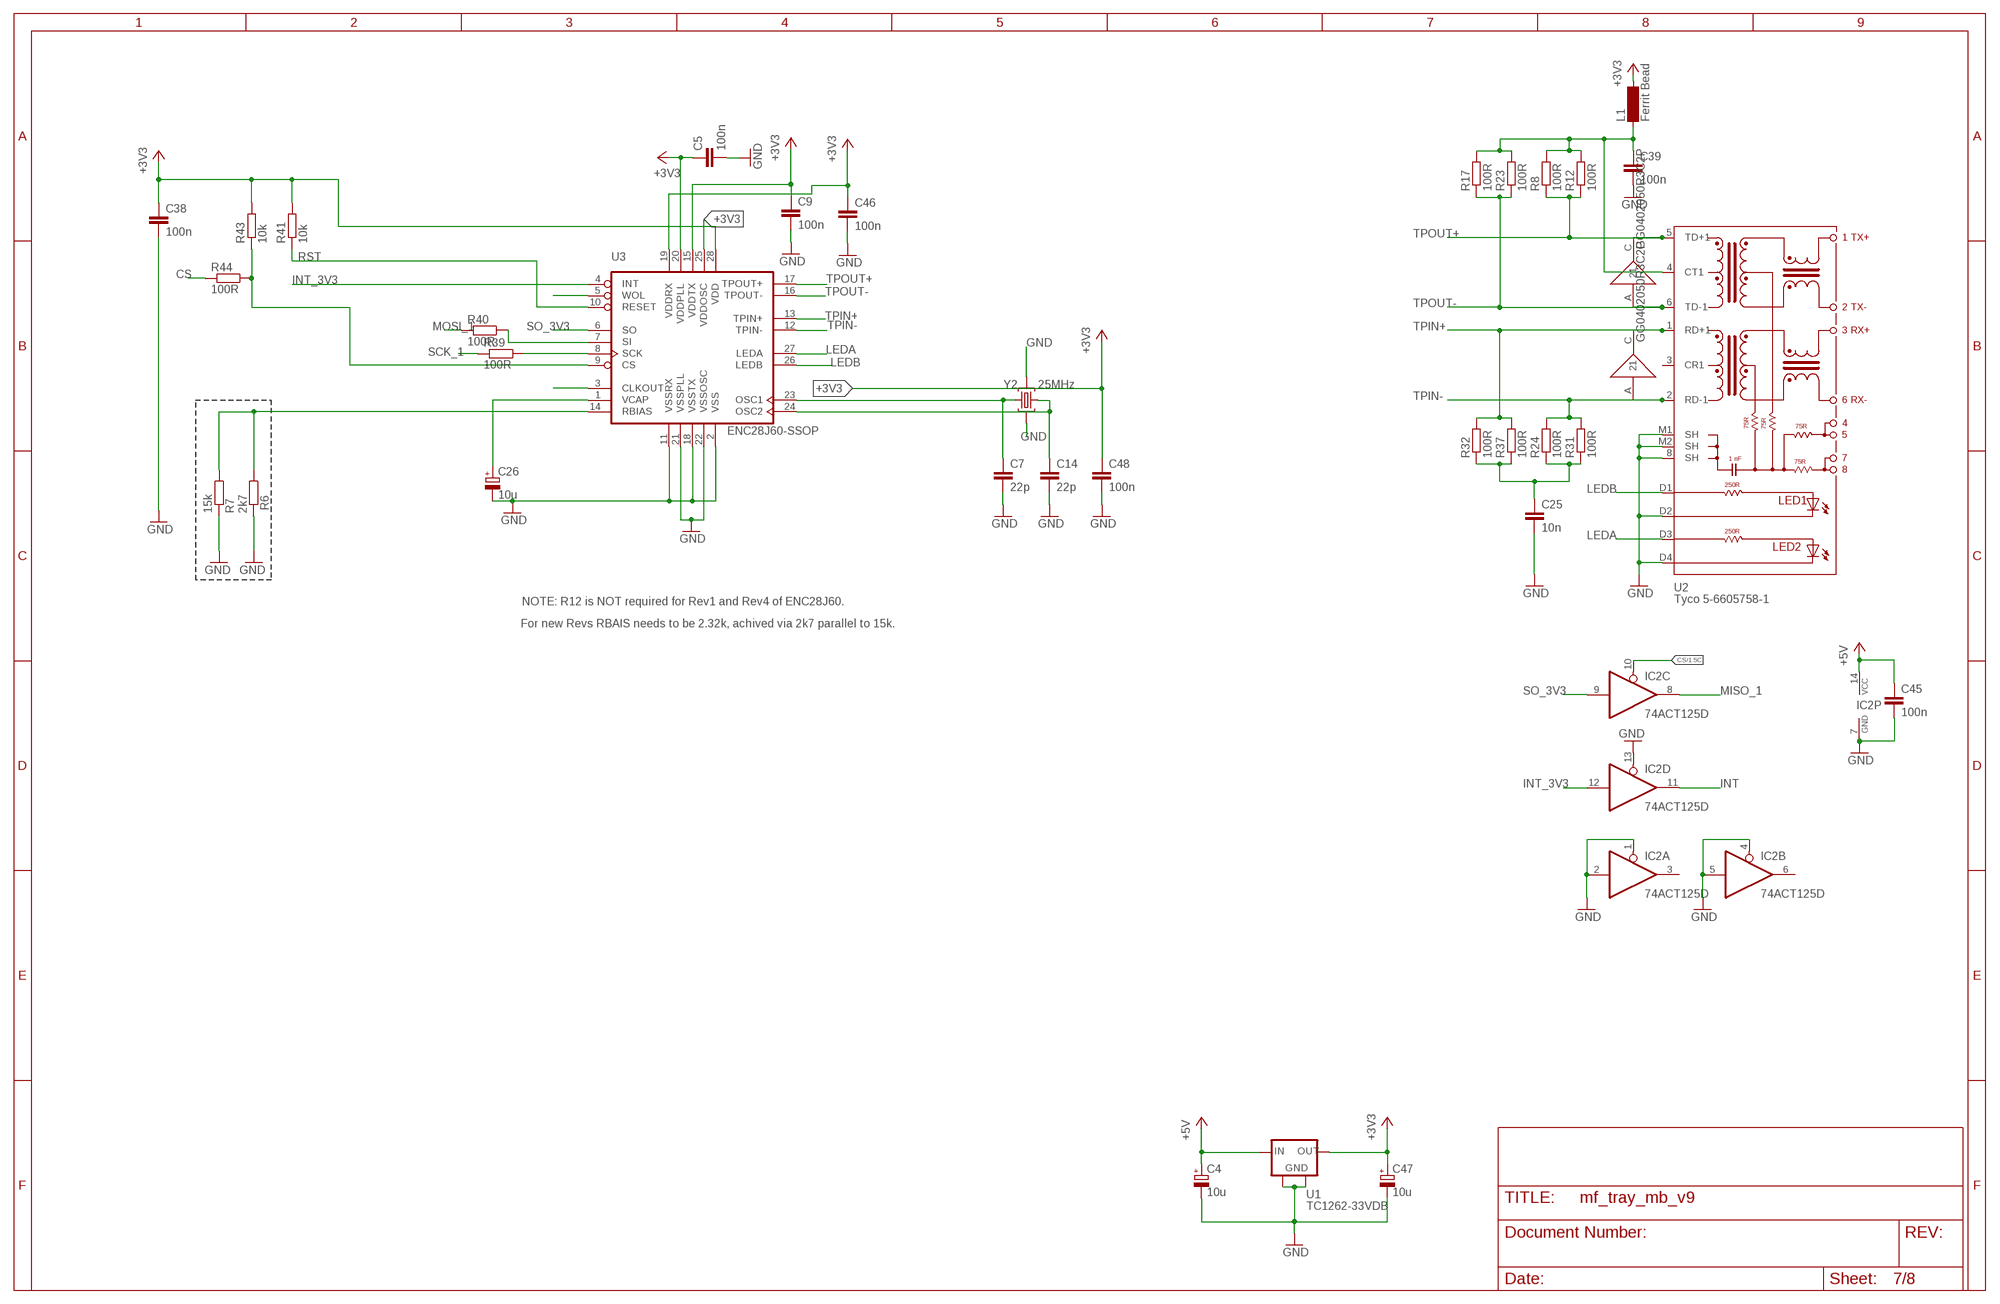
[diagram p6: schematic, sheet 7]

### Parts
C4  10u  CPOL-EU153CLV-0605  [153CLV-0605]
C5  100n  C-EUC0603  [C0603]
C7  22p  C-EUC0603  [C0603]
C9  100n  C-EUC0603  [C0603]
C14  22p  C-EUC0603  [C0603]
C25  10n  C-EUC0603  [C0603]
C26  10u  CPOL-EU153CLV-0605  [153CLV-0605]
C38  100n  C-EUC0603  [C0603]
C39  100n  C-EUC0603  [C0603]
C45  100n  C-EUC0603  [C0603]
C46  100n  C-EUC0603  [C0603]
C47  10u  CPOL-EU153CLV-0605  [153CLV-0605]
C48  100n  C-EUC0603  [C0603]
IC2  74ACT125D  [SO14]
L1  Ferrit Bead  SM-1206  [SM-1206]
R6  2k7  R-EU_R0603  [R0603]
R7  15k  R-EU_R0603  [R0603]
R8  100R  R-EU_R0603  [R0603]
R12  100R  R-EU_R0603  [R0603]
R17  100R  R-EU_R0603  [R0603]
R23  100R  R-EU_R0603  [R0603]
R24  100R  R-EU_R0603  [R0603]
R31  100R  R-EU_R0603  [R0603]
R32  100R  R-EU_R0603  [R0603]
R37  100R  R-EU_R0603  [R0603]
R39  100R  R-EU_R0603  [R0603]
R40  100R  R-EU_R0603  [R0603]
R41  10k  R-EU_R0603  [R0603]
R43  10k  R-EU_R0603  [R0603]
R44  100R  R-EU_R0603  [R0603]
U1  TC1262-33VDB  TC1262-50VDB  [SOT223]
U2  Tyco 5-6605758-1  5-6605758-1  [5-6605758-1]
U3  ENC28J60-SSOP  [SSOP28]
U$6  GG0402050R3C2P  [0402]
U$7  GG0402050R3C2P  [0402]
Y2  25MHz  CRYSTAL-3.2-2.5  [CRYSTAL-3.2-2.5]

### Nets
+3V3: C5.1 C9.1 C38.1 C46.1 C47.+ C48.1 L1.2 R41.2 R43.2 U1.3(OUT) U3.15(VDDTX) U3.19(VDDRX) U3.20(VDDPLL) U3.25(VDDOSC) U3.28(VDD) ; also sheet 3
+5V: C4.+ C45.1 IC2.14(P:VCC) U1.1(IN) ; also sheet 1,2,3,4,5,6
CS: IC2.10(C:OE) R44.2 ; also sheet 1
GND: C4.- C5.2 C7.2 C9.2 C14.2 C25.2 C26.- C38.2 C39.2 C45.2 C46.2 C47.- C48.2 IC2.1(A:OE) IC2.2(A:I) IC2.4(B:OE) IC2.5(B:I) IC2.7(P:GND) IC2.13(D:OE) R6.2 R7.2 U1.2(GND) U1.4(GND) U2.8(SH) U2.D2 U2.D4 U2.M1(SH) U2.M2(SH) U3.2(VSS) U3.11(VSSRX) U3.18(VSSTX) U3.21(VSSPLL) U3.22(VSSOSC) Y2.2(GND) Y2.4(GND) ; also sheet 1,2,3,4,5,6
INT: IC2.11(D:O) ; also sheet 1
INT_3V3: IC2.12(D:I) U3.4(INT)
LEDA: U2.D3 U3.27(LEDA)
LEDB: U2.D1 U3.26(LEDB)
MISO_1: IC2.8(C:O) ; also sheet 1,2
MOSI_1: R40.2 ; also sheet 1,2
N$15: R6.1 R7.1 U3.14(RBIAS)
N$21: C7.1 U3.23(OSC1) Y2.3(C2)
N$22: C25.1 R24.1 R31.1 R32.1 R37.1
N$23: C39.1 L1.1 R8.2 R12.2 R17.2 R23.2 U2.4(CT1)
N$25: C14.1 U3.24(OSC2) Y2.1(C1)
N$29: R43.1 R44.1 U3.9(CS)
N$32: U3.5(WOL)
N$34: R40.1 U3.7(SI)
N$36: R39.1 U3.8(SCK)
N$38: U3.3(CLKOUT)
N$39: C26.+ U3.1(VCAP)
RST: R41.1 U3.10(RESET)
SCK_1: R39.2 ; also sheet 1,2
SO_3V3: IC2.9(C:I) U3.6(SO)
TPIN+: R32.2 R37.2 U2.1(RD+1) U3.13(TPIN+) U$7.C
TPIN-: R24.2 R31.2 U2.2(RD-1) U3.12(TPIN-) U$7.A
TPOUT+: R8.1 R12.1 U2.5(TD+1) U3.17(TPOUT+) U$6.C
TPOUT-: R17.1 R23.1 U2.6(TD-1) U3.16(TPOUT-) U$6.A
Unconnected: IC2.3(A:O) IC2.6(B:O) U2.3(CR1)

### Notes on the sheet
- NOTE: R12 is NOT required for Rev1 and Rev4 of ENC28J60.
- For new Revs RBAIS needs to be 2.32k, achived via 2k7 parallel to 15k.

## Sheet 8 of 8: Release Notes
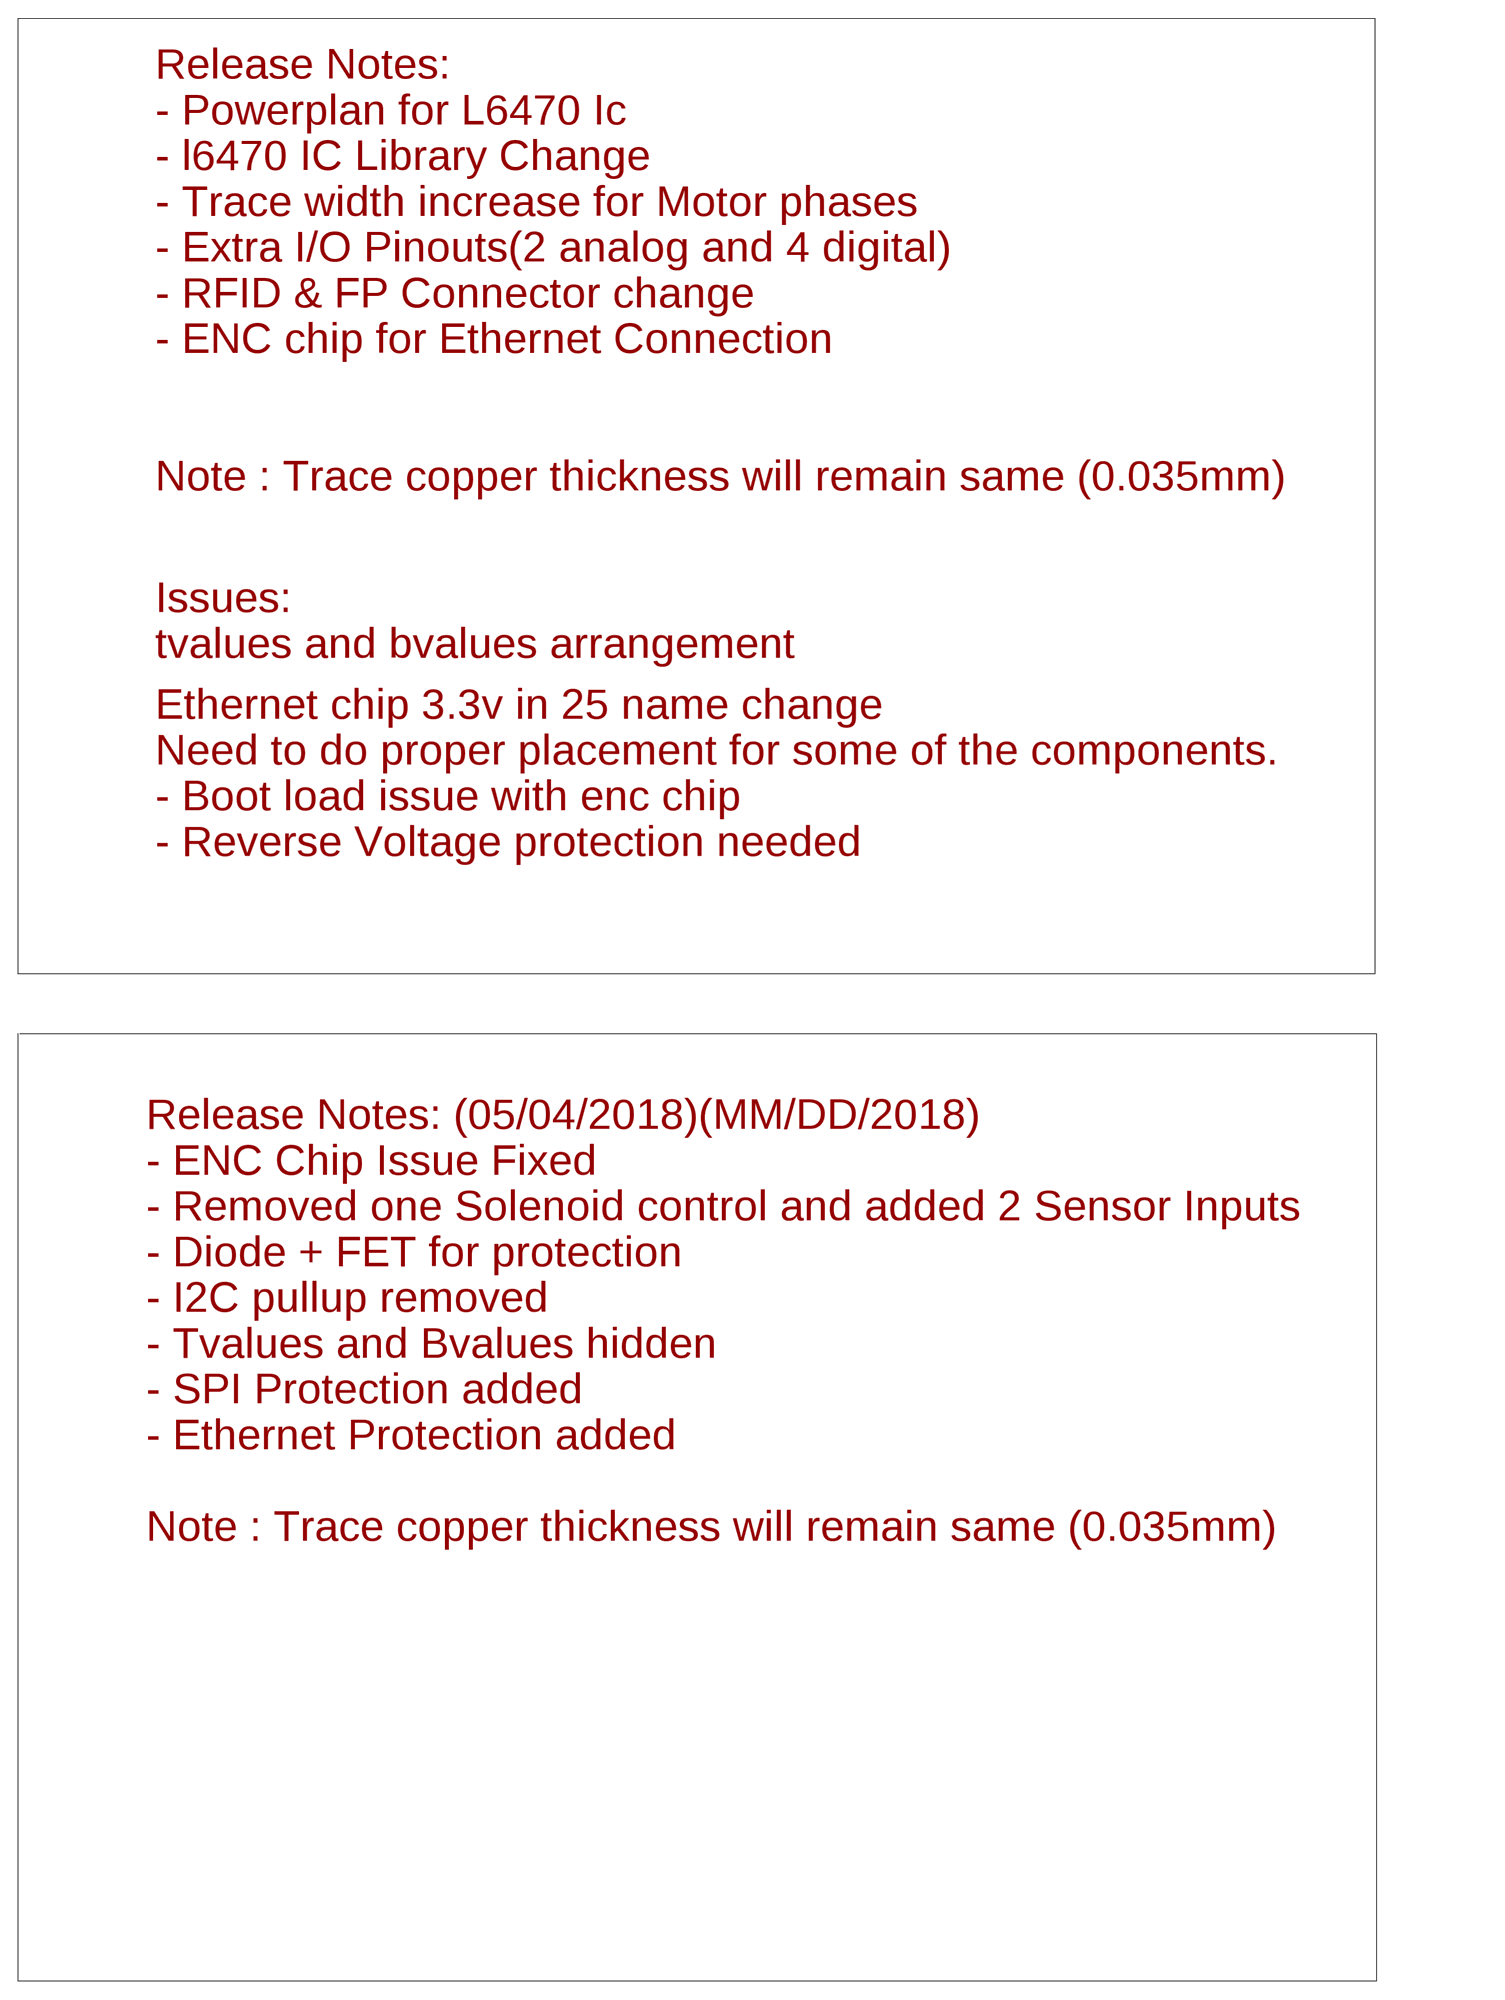
[diagram p7: schematic, sheet 8]

### Notes on the sheet
- Release Notes:
  - Powerplan for L6470 Ic
  - l6470 IC Library Change
  - Trace width increase for Motor phases
  - Extra I/O Pinouts(2 analog and 4 digital)
  - RFID & FP Connector change
  - ENC chip for Ethernet Connection
  
  
  Note : Trace copper thickness will remain same (0.035mm)
- Issues:
- tvalues and bvalues arrangement
- Ethernet chip 3.3v in 25 name change
- Need to do proper placement for some of the components.
- - Boot load issue with enc chip
- - Reverse Voltage protection needed
- Release Notes: (05/04/2018)(MM/DD/2018)
  - ENC Chip Issue Fixed
  - Removed one Solenoid control and added 2 Sensor Inputs
  - Diode + FET for protection
  - I2C pullup removed
  - Tvalues and Bvalues hidden
  - SPI Protection added
  - Ethernet Protection added
  
  Note : Trace copper thickness will remain same (0.035mm)

## Library data of the parts
12+PWR EMLOCK RS-485 = SRG:JST-PH_2-PIN_HEADER: 2-pin JST PH Shrouded Header, top entry P/N B2B-PH-K-S Mating connector PHR-2 Mating cable assembly: Sparkfun PRT-09914 <http://www.sparkfun.com/products/9914>
C1 C42 = rcl:C-EU: CAPACITOR, European symbol; MANUFACTURER: Kemet; PARTNR: C0603C104K3RACTU; TYPE: X7R; VOLTAGE: 25V
C4 C26 C47 = resistor:CPOL-EU: POLARIZED CAPACITOR, European symbol
C5 C7 C9 C14 C16 C25 C38 C39 C45 C46 C48 = rcl:C-EU: CAPACITOR, European symbol
C6 C10-C13 C15 C17 C18 C29 = SmartPrj:C-EU: CAPACITOR, European symbol
C19 C32 = rcl:C-EU: CAPACITOR, European symbol; MANUFACTURER: AVX; PARTNR: 0603YC224MAT2A; TYPE: X7R; VOLTAGE: 16V
C20 C33 = rcl:C-EU: CAPACITOR, European symbol; MANUFACTURER: Vishay; PARTNR: VJ0603Y103KXAAC; TYPE: X7R; VOLTAGE: 50V
C21-C24 C34-C37 = rcl:C-EU: CAPACITOR, European symbol; MANUFACTURER: Kemet; PARTNR: C0603C104K5RACTU; TYPE: X7R; VOLTAGE: 50V
C27 C40 = rcl:C-EU: CAPACITOR, European symbol; MANUFACTURER: Vishay; PARTNR: VJ0603Y102MXQCW1BC; TYPE: X7R; VOLTAGE: 10V
C28 C41 = rcl:C-EU: CAPACITOR, European symbol; MANUFACTURER: Taiyo Yuden; PARTNR: JMK316B7226ML-T; TYPE: X7R; VOLTAGE: 6.3V
C30 C43 = rcl:C-EU: CAPACITOR, European symbol; MANUFACTURER: Kemet; PARTNR: C0603C105K4RACTU; TYPE: X7R; VOLTAGE: 16V
C31 C44 = SparkFun-Capacitors:100UF-63V-20%(ELECT): CAP-08362 100uF electrolytic SMT 63V 20%; MOUSER: 647-UUX1J101MNL1GS; PROD_ID: CAP-08362
CC1 = rcl:CPOL-EU: POLARIZED CAPACITOR, European symbol
D1 = diode:DIODE-: DIODE
D2 = _mod_diode:SM400*: SM4001 .. SM4007 General Purpose Rectifier, 1 A SMD-Version of 1N4001 .. 1N4007 Case: MELF-MLL41 = DO 213 AB Author: Dipl.-Ing. FH Rainer Bayer HHN Hochschule Heilbronn, rainer.bayer@hs-heilbronn.de Ingenieurbüro ing-rb, mail@ing-rb.de
D3 = 1sma59xx_10:1SMA59*BT3G: 1SMA59xxBT3G Series 1.5 Watt Plastic Surface Mount Zener Voltage Regulators Source: http://www.onsemi.com/pub_link/Collateral/1SMA5913BT3-D.PDF; MF: ON Semiconductor; MPN: 1SMA5925BT3G; OC_FARNELL: 1431147; OC_NEWARK: 71J9198
D4 D5 = diode:BAT54S: Schottky Diodes Pin connection corrected 2011-05-04 Source: Fairchild .. BAT54.pdf; MANUFACTURER: NXP; PARTNR: BAV99,215
D13 PWR-LED RX TX = led:LED: LED OSRAM: - CHIPLED LG R971, LG N971, LY N971, LG Q971, LY Q971, LO R971, LY R971 LH N974, LH R974 LS Q976, LO Q976, LY Q976 LO Q996 - Hyper CHIPLED LW Q18S LB Q993, LB Q99A, LB R99A - SideLED LS A670, LO A670, LY A670, LG A670, LP A670 LB A673, LV A673, LT A673, LW A673 LH A674 LY A675 LS A676, LA A676, LO A676, LY A676, LW A676 LS A679, LY A679, LG A679 - Hyper Micro SIDELED® LS Y876, LA Y876, LO Y876, LY Y876 LT Y87S - SmartLED LW L88C, LW L88S LB L89C, LB L89S, LG L890 LS L89K, LO L89K, LY L89K LS L896, LA L896, LO L896, LY L896 - TOPLED LS T670, LO T670, LY T670, LG T670, LP T670 LSG T670, LSP T670, LSY T670, LOP T670, LYG T670 LG T671, LOG T671, LSG T671 LB T673, LV T673, LT T673, LW T673 LH T674 LS T676, LA T676, LO T676, LY T676, LB T676, LH T676, LSB T676, LW T676 LB T67C, LV T67C, LT T67C, LS T67K, LO T67K, LY T67K, LW E67C LS E67B, LA E67B, LO E67B, LY E67B, LB E67C, LV E67C, LT E67C LW T67C LS T679, LY T679, LG T679 LS T770, LO T770, LY T770, LG T770, LP T770 LB T773, LV T773, LT T773, LW T773 LH T774 LS E675, LA E675, LY E675, LS T675 LS T776, LA T776, LO T776, LY T776, LB T776 LHGB T686 LT T68C, LB T68C - Hyper Mini TOPLED® LB M676 - Mini TOPLED Santana® LG M470 LS M47K, LO M47K, LY M47K Source: http://www.osram.convergy.de LUXEON: - LUMILED® LXK2-PW12-R00, LXK2-PW12-S00, LXK2-PW14-U00, LXK2-PW14-V00 LXK2-PM12-R00, LXK2-PM12-S00, LXK2-PM14-U00 LXK2-PE12-Q00, LXK2-PE12-R00, LXK2-PE12-S00, LXK2-PE14-T00, LXK2-PE14-U00 LXK2-PB12-K00, LXK2-PB12-L00, LXK2-PB12-M00, LXK2-PB14-N00, LXK2-PB14-P00, LXK2-PB14-Q00 LXK2-PR12-L00, LXK2-PR12-M00, LXK2-PR14-Q00, LXK2-PR14-R00 LXK2-PD12-Q00, LXK2-PD12-R00, LXK2-PD12-S00 LXK2-PH12-R00, LXK2-PH12-S00 LXK2-PL12-P00, LXK2-PL12-Q00, LXK2-PL12-R00 Source: www.luxeon.com KINGBRIGHT: KA-3528ASYC Source: www.kingbright.com
DC2DC_1 = SteelCaveRobotics-Power:TSR1-2450: Traco Power TSR 1-2450 5.0v switching regulator
EM_GND EM_PWR = jumper:SJ2W: SMD solder JUMPER
F1 = rcl:L-EU: INDUCTOR, European symbol
FP M-SENSOR MOTOR_1 MOTOR_2 RFID-READER SENSOR = con-phoenix-254:MPT4: PHOENIX CONNECTOR; OC_FARNELL: unknown; OC_NEWARK: unknown
IC2 = 74xx-eu:74*125: Quad bus BUFFER, 3-state
IC6 = SmartPrj:ATMEGA2560: MICROCONTROLLER 64/128/256 Kbytes FLASH 4 Kbytes EEPROM 8 Kbytes SRAM 86 General Purpose I/O pins 12-channels16-bit PWM 4 x Serial USARTs 16-channels 10-bit A/D
IC7 = SparkFun:FT232RL: USB UART FT232RL 4th Generation USB UART (USB <-> Serial) Controller. Spark Fun Electronics SKU : COM-00650
IC8 = texas:75ALS176: DIFFERENTIAL BUS TRANSCEIVERS TIA/EIA-422-B, TIA/EIA-422-B + TIA/EIA-422-B TIA/EIA-422-B Operate at Data Rates up to 35 Mbaud Source: http://focus.ti.com/lit/ds/symlink/sn65als176.pdf; MF: TEXAS INSTRUMENTS; MPN: SN75ALS176AD; OC_FARNELL: 1410742; OC_NEWARK: 76C5099
IC$1 IC$2 = L6470PD:L6470
ICSP = SmartPrj:PINHD-2X3: PIN HEADER
JP2 = pinhead:PINHD-1X9: PIN HEADER
L1 = inductor-neosid:SM-1206: INDUCTOR SMD chip inductor
L20 L21 = SparkFun:LED: LEDs Standard schematic elements and footprints for 5mm, 3mm, 1206, and 0603 sized LEDs. 5mm - Spark Fun Electronics SKU : COM-00529 (and others)
OC1 = avago:ACPL-247
PFET-M = FQP47P06:FQP47P06
R1-R5 R9-R11 R15 R16 R18-R22 R26 R27 RC1-RC4 = resistor:R-US_: RESISTOR, American symbol
R6-R8 R12 R17 R23 R24 R31 R32 R37 R39-R41 R43 R44 = rcl:R-EU_: RESISTOR, European symbol
R13 R14 = SmartPrj:R-EU_: RESISTOR, European symbol
R25 R33 = rcl:R-EU_: RESISTOR, European symbol; MANUFACTURER: Vishay; PARTNR: CRCW060339K0FKEA
R28 R29 R34 R35 = rcl:R-EU_: RESISTOR, European symbol; MANUFACTURER: -; PARTNR: -; PLACED: NO
R30 R36 = SparkFun:RESISTOR: Resistor Basic schematic elements and footprints for 0603, 1206, and PTH resistors.
R38 = resistor:R-EU_: RESISTOR, European symbol
SOL = con-phoenix-254:MPT2: PHOENIX CONNECTOR; OC_FARNELL: unknown; OC_NEWARK: unknown
U1 = v-reg-misc:TC1262
U2 = con-tycoelectronics-1:5-6605758-1
U3 = microchip-enc28j60:ENC28J60-*: Microchip 10Mbit Eth. contoller with SPI interface
U3V12F12 = pinhead:PINHD-1X3: PIN HEADER
U$1 U$3-U$7 = GG0402050R3C2P:GG0402050R3C2P
U$2 = SOT:RCLAMP0582BQ
U$10 = con-amphenol-rj45-ld:RJ45-TOP-1-406541-1-CAN-MB
USB = SparkFun-Connectors:USB: USB Connectors USB-B-PTH is fully proven SKU : PRT-00139/CONN-08278 USB-miniB is fully proven SKU : PRT-00587 USB-A-PCB is untested. USB-A-H is throughly reviewed, but untested. Spark Fun Electronics SKU : PRT-00437 USB-B-SMT is throughly reviewed, but untested. Needs silkscreen touching up. USB-A-S has not been used/tested USB-MB-H has not been used/tested USB-MICROB has been used. CONN-09505
Y1 = SmartPrj:RESONATOR
Y2 = SmartPrj:CRYSTAL-3.2-2.5
Z2 Z3 = semicon-smd-ipc:NPN-TRANSISTIOR-2COL: NPN TRANSISTOR 2 colletor pins

## Net classes
1 power: width 0.406 mm, drill 0.254 mm, clearance 0.152 mm
2 Massa: width 1.2 mm, drill 0.6 mm, clearance 0.2 mm
3 Mot: width 1.2 mm, drill 0.8 mm, clearance 0.005 mm
4 aref: width 0.305 mm, drill 0.61 mm, clearance 0.254 mm
5 0.6096: width 0.61 mm, drill 0.406 mm, clearance 0.254 mm
6 0.900: width 0.9 mm, drill 0.6 mm, clearance 0.5 mm